# EasyEDA Pro project ProDoc_PT2470.epro

# Schematic Schematic1

## Sheets
1 stm32最小系统: Create Date: 2022-11-15; Page Name: stm32最小系统; Project Name: 四电机驱动板1; Schematic Name: Schematic1; Update Date: 2022-11-18; Add into BOM: yes; Convert to PCB: yes
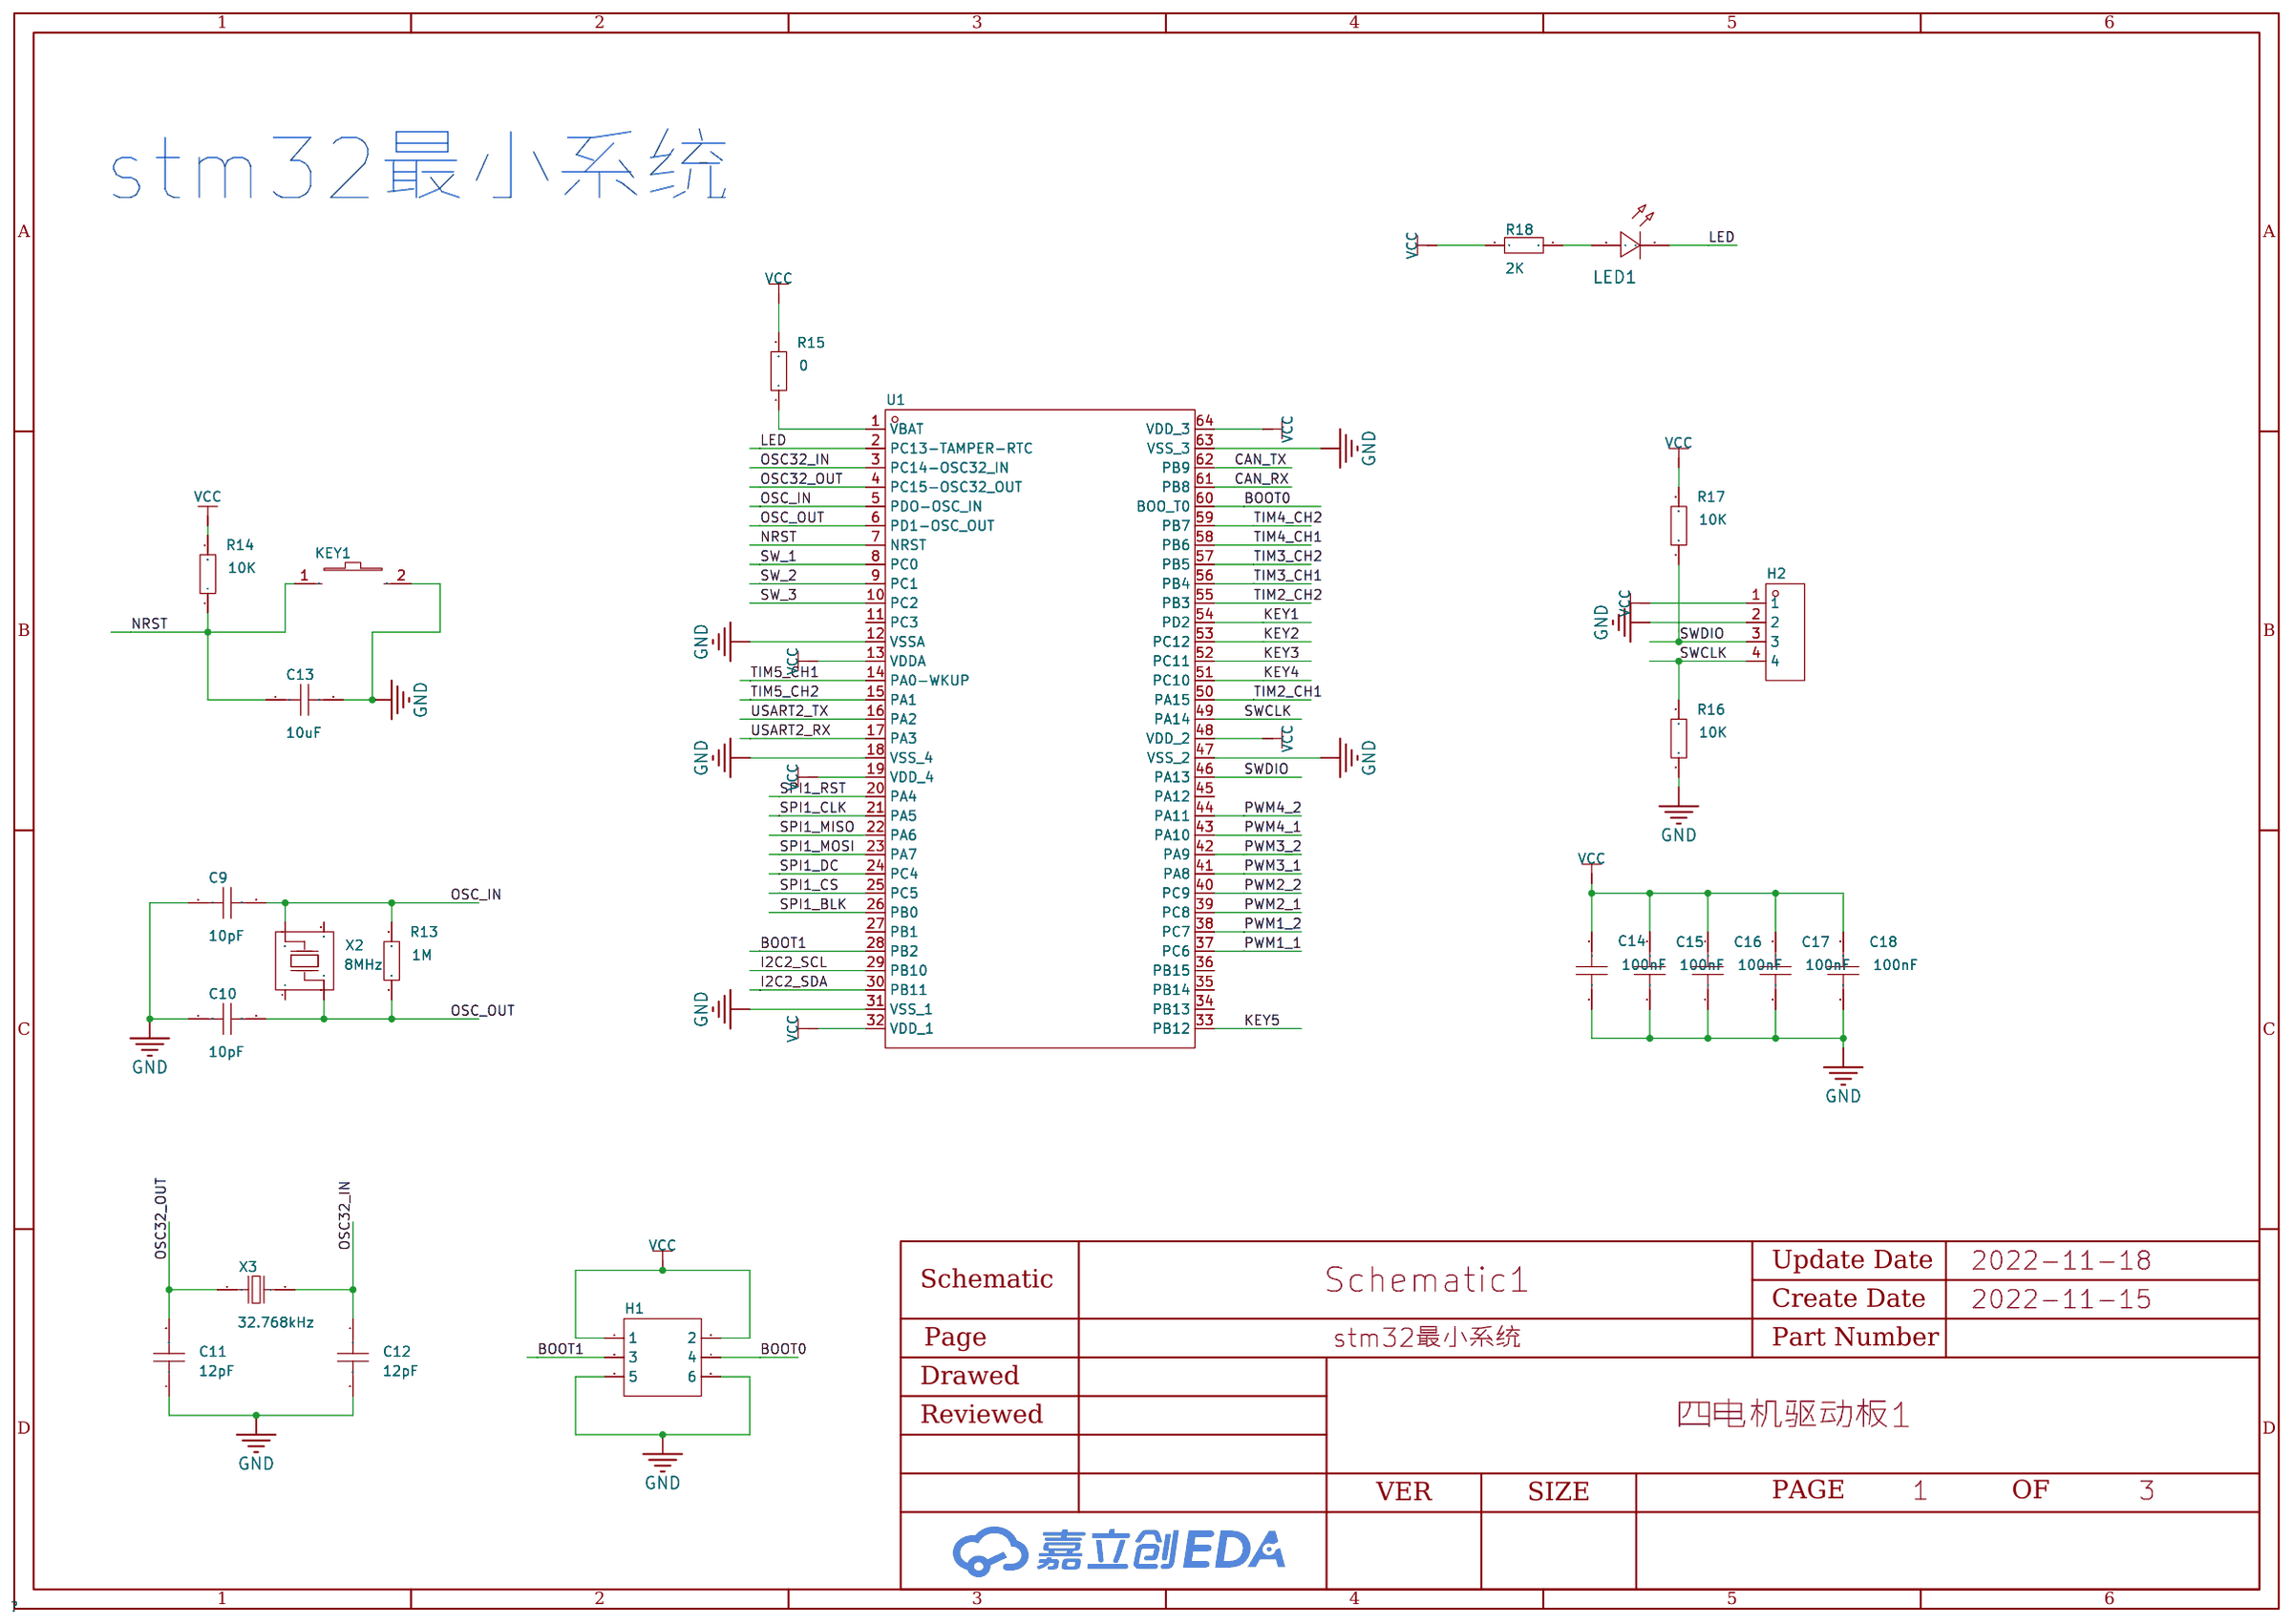
[diagram p0: stm32最小系统]
2 电机驱动PT2470: Page Name: 电机驱动PT2470; Company: 嘉立创EDA; Page Size: A4; Version: V1.0
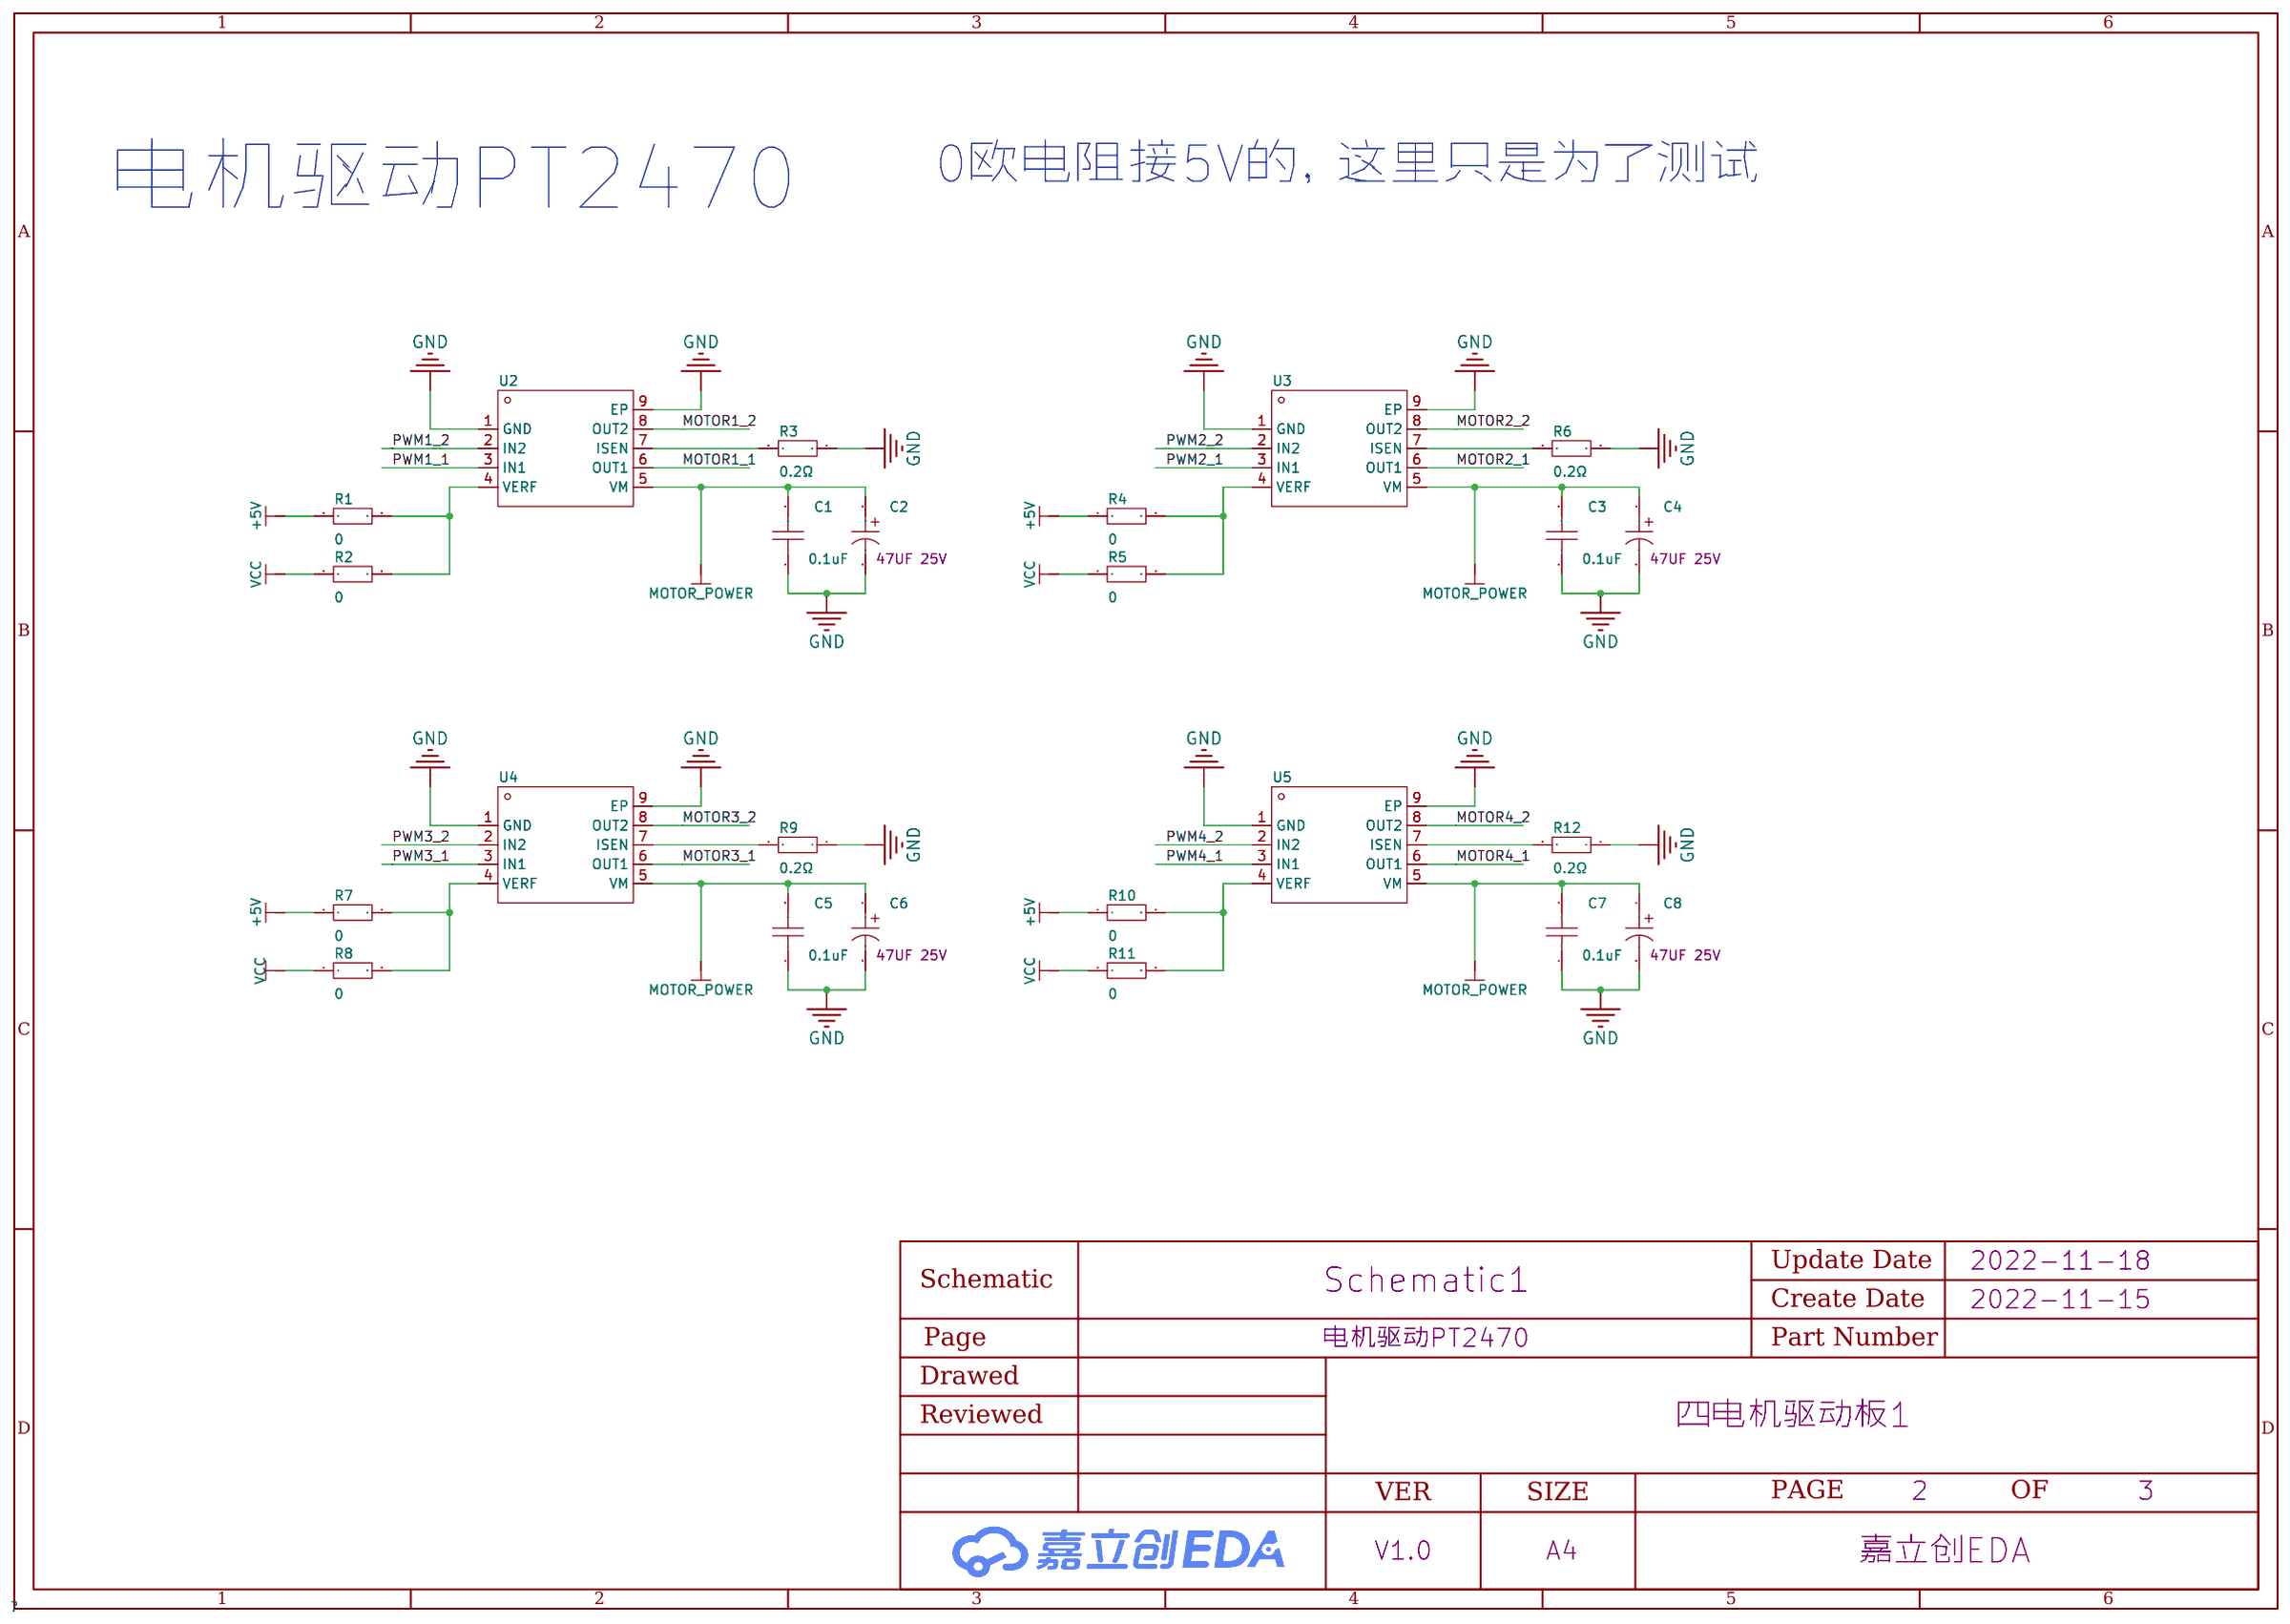
[diagram p1: 电机驱动PT2470]
3 其他模块: Page Name: 其他模块; Company: 嘉立创EDA; Page Size: A4; Version: V1.0
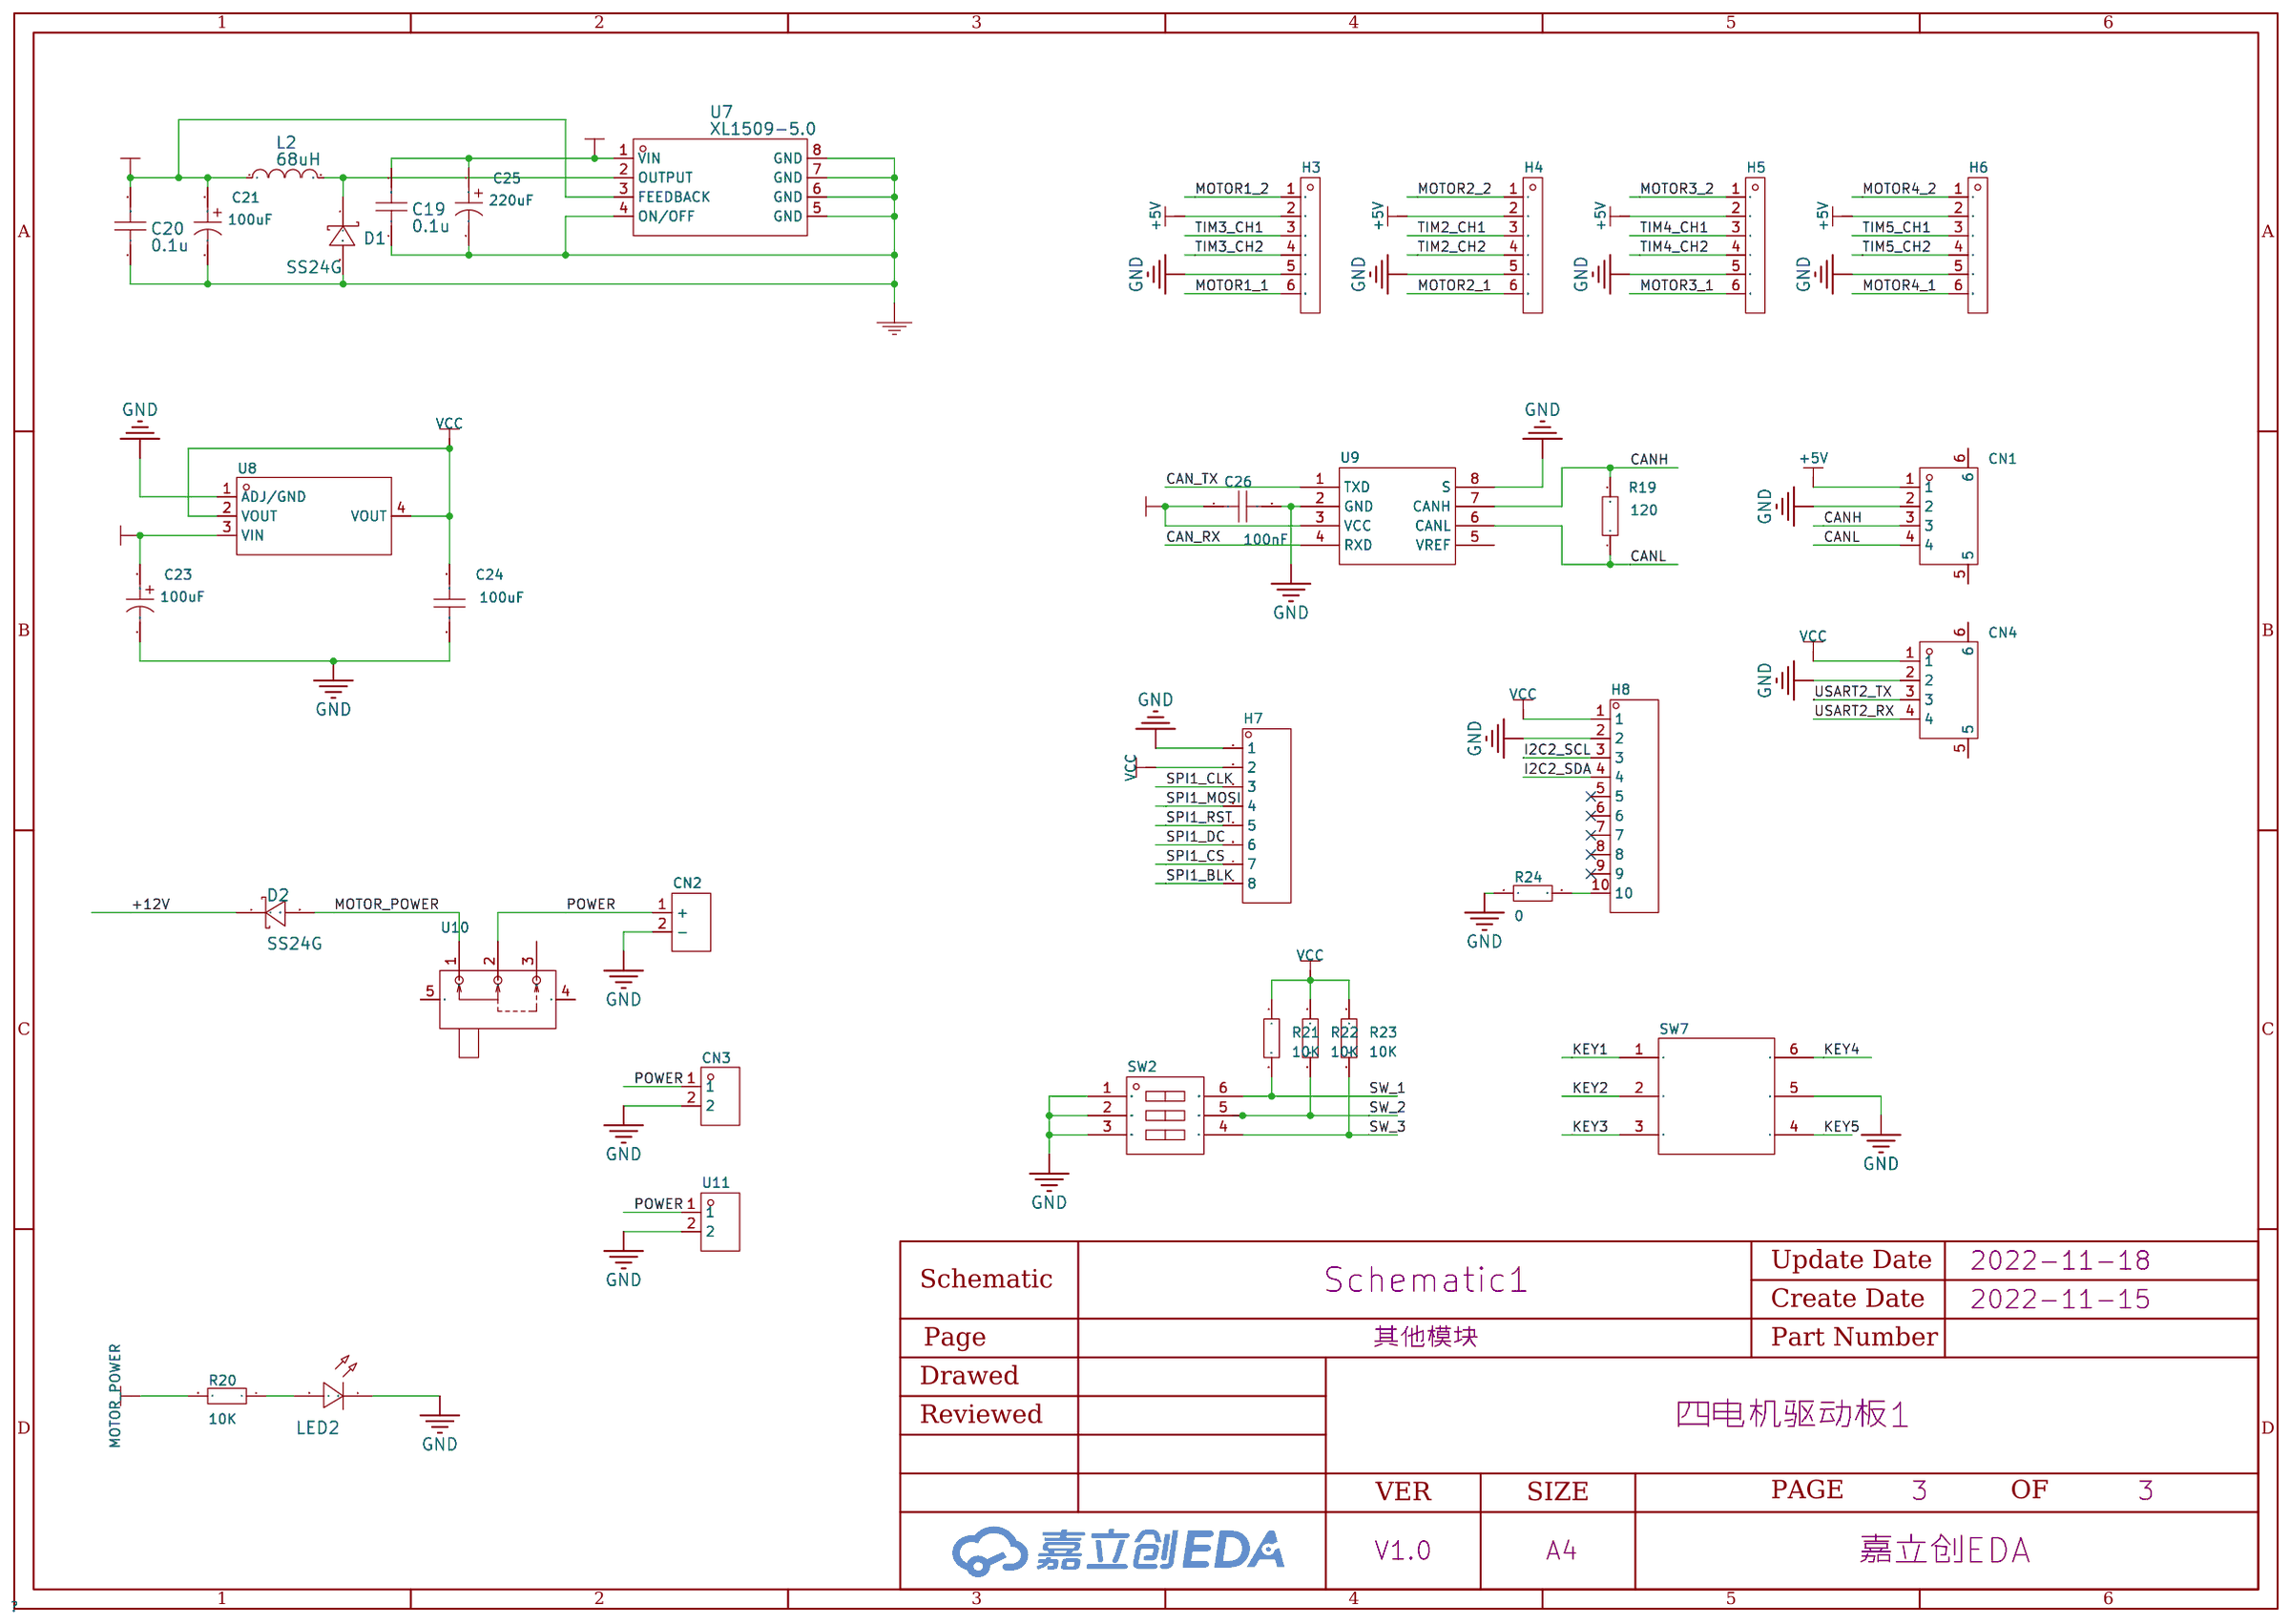
[diagram p2: 其他模块]

## Parts
sheet stm32最小系统
C9  10pF  [C0603]
C10  10pF  [C0603]
C11  12pF  [C0603]
C12  12pF  [C0603]
C13  10uF  [C0603]
C14  100nF  [C0603]
C15  100nF  [C0603]
C16  100nF  [C0603]
C17  100nF  [C0603]
C18  100nF  [C0603]
H1  -  [HDR-TH_6P-P2.54-V-F-R2-C3-S2.54]
H2  -  [HDR-TH_4P-P2.54-V-M]
KEY1  轻触开关3x4x2  [SW-SMD_L4.0-W2.9-LS5.0]
LED1  -  [LED0805-RD_RED]
R13  1M  [R0603]
R14  10K  [R0603]
R15  0  [R0805]
R16  10K  [R0603]
R17  10K  [R0603]
R18  2K  [R0603]
U1  -  [LQFP-64_L10.0-W10.0-P0.50-LS12.0-BL]
X2  8MHz  [OSC-SMD_4P-L3.2-W2.5-BL]
X3  32.768kHz  [FC-135R_L3.2-W1.5]
sheet 其他模块
C19  0.1u  [C0603]
C20  0.1u  [C0603]
C21  100uF  [CAP-SMD_BD6.3-L6.6-W6.6-LS7.3-FD]
C23  100uF  [CAP-SMD_BD6.3-L6.6-W6.6-LS7.3-FD]
C24  100uF  [C0603]
C25  220uF  [CAP-SMD_BD6.3-L6.6-W6.6-LS7.3-FD]
C26  100nF  [C0603]
CN1  PH-4P卧贴  [CONN-SMD_PH2.0-4PWB]
CN2  XT30UPB-F  [CONN-TH_XT30UPB-F]
CN3  XT30U-M  [CONN-TH_XT30U-M]
CN4  PH-4P卧贴  [CONN-SMD_PH2.0-4PWB]
D1  SS24G  [SMA_L4.4-W2.8-LS5.4-RD]
D2  SS24G  [SMA_L4.4-W2.8-LS5.4-RD]
H3  -  [CONN-TH_XH-6AW]
H4  -  [CONN-TH_XH-6AW]
H5  -  [CONN-TH_XH-6AW]
H6  -  [CONN-TH_XH-6AW]
H7  -  [HDR-TH_8P-P2.54-V-M]
H8  -  [HDR-TH_10P-P2.54-V-M-1]
L2  68uH  [IND-SMD_L5.8-W5.2_CD54T125NP-100MC]
LED2  -  [LED0805-RD_RED]
R19  120  [R0603]
R20  10K  [R0603]
R21  10K  [R0603]
R22  10K  [R0603]
R23  10K  [R0603]
R24  0  [R0603]
SW2  TO-03  [SW-SMD_6P-L7.6-W6.3-P2.54-LS9.8]
SW7  7*7*5-6P-L WX  [SW-SMD_6P-L7.0-W7.0-P1.40-LS7.4]
U7  XL1509-5.0  [SOIC-8_L5.0-W4.0-P1.27-LS6.0-BL]
U8  AMS1117-3.3  [SOT-223_L6.5-W3.5-P2.30-LS7.0-BR]
U9  TJA1050T/CM,118  [SOIC-8_L5.0-W4.0-P1.27-LS6.0-BL]
U10  SS-12F23-G4  [SW-TH_SS-12F23-G040]
U11  KF127-5.08-2P  [CONN-TH_P5.08_KF127-5.08-2P]
sheet 电机驱动PT2470
C1  0.1uF  [C0603]
C2  -  [CAP-SMD_BD6.3-L6.6-W6.6-LS7.6-FD]
C3  0.1uF  [C0603]
C4  -  [CAP-SMD_BD6.3-L6.6-W6.6-LS7.6-FD]
C5  0.1uF  [C0603]
C6  -  [CAP-SMD_BD6.3-L6.6-W6.6-LS7.6-FD]
C7  0.1uF  [C0603]
C8  -  [CAP-SMD_BD6.3-L6.6-W6.6-LS7.6-FD]
R1  0  [R0603]
R2  0  [R0603]
R3  0.2Ω  [R1206]
R4  0  [R0603]
R5  0  [R0603]
R6  0.2Ω  [R1206]
R7  0  [R0603]
R8  0  [R0603]
R9  0.2Ω  [R1206]
R10  0  [R0603]
R11  0  [R0603]
R12  0.2Ω  [R1206]
U2  -  [HSOP-8_L5.0-W4.0-P1.27-LS6.2-BL-EP]
U3  -  [HSOP-8_L5.0-W4.0-P1.27-LS6.2-BL-EP]
U4  -  [HSOP-8_L5.0-W4.0-P1.27-LS6.2-BL-EP]
U5  -  [HSOP-8_L5.0-W4.0-P1.27-LS6.2-BL-EP]

## Library data of the parts
C1 C3 C5 C7 C9-C12 C24 C26 = CAP_0603: Supplier Footprint: 0603
C13 = C0603: 容值:100nF;精度:±10%;额定电压:50V;材质(温度系数):X7R;; LCSC Part Name: 100nF ±10% 50V; Supplier Part: C14663; Manufacturer: YAGEO(国巨); Manufacturer Part: CC0603KRX7R9BB104; Supplier Footprint: 0603; JLCPCB Part Class: Basic Part; Datasheet: https://atta.szlcsc.com/upload/public/pdf/source/20170116/1484561234239.pdf; Supplier: LCSC; Tolerance: ±10%; Voltage Rated: 50V; Temperature Coefficient: X7R
C14-C18 = CAP_0805: Supplier Footprint: 0805
H1 = HDR-F_2.54_2x3: Supplier Part: C92272; Supplier Footprint: 插件
H2 = HDR-M_2.54_1x4P: Supplier Part: C492403; Supplier Footprint: 插件
KEY1 = 轻触开关3x4x2: 触点电流:50mA;额定电压(DC):12V;电路结构:单刀单掷;安装方式:立贴;按钮形状:圆形按钮;带灯:-;开关长度:4mm;开关宽度:3mm;开关高度:2mm;; LCSC Part Name: 3x4x2  柱高0.5; Supplier Part: C26638; Manufacturer: 国产; Supplier Footprint: SMD; JLCPCB Part Class: 扩展库; Datasheet: https://atta.szlcsc.com/upload/public/pdf/source/20150923/1457707412058.pdf; Supplier: LCSC; Contact Current: 50mA; Voltage Rating (DC): 12V; Circuit: 单刀单掷; Mounting Style: 立贴; Actuator Style: 圆形按钮; Switch Length: 4mm; Switch Width: 3mm; Switch Height: 2mm
LED1 LED2 = LED_0805-R: Supplier Footprint: 0805
R1 R2 R4 R5 R7 R8 R10 R11 R13 R14 R16-R24 = Res_0603: Supplier Footprint: 0603
R15 = Res_0805: Supplier Footprint: 0805
U1 = STM32F103RCT6: 主频（MAX):72MHz;工作电压:2V ~ 3.6V;; Supplier Part: C8323; Manufacturer: ST(意法半导体); Supplier Footprint: LQFP-64_10x10x05P; JLCPCB Part Class: Extended Part; Datasheet: https://atta.szlcsc.com/upload/public/pdf/source/20161130/1480498797345.pdf; Supplier: LCSC; Speed: 72MHz; Voltage - Supply (Vcc/Vdd): 2V ~ 3.6V; Program Memory Size: 256KB; RAM Size: 48KB; Number of I/O: 51; A/D: 16x12bit; D/A: 2x12bit; PWM: 18; LCD: LCD parallel interface, 8080/6800 modes; UART/USART: 3 USART+2 UART; SPI: 3; I2C（SMBUS/PMBUS）: 2; USB Device: 1; CAN: 1
X2 = TAXM8M4RDBCCT2T: 晶振类型:SMD 谐振器;频率:8MHz;频率公差:±10ppm;频率稳定度:±15ppm;负载电容:10pF;等效串联电阻(ESR):250Ω;工作温度:-;; LCSC Part Name: 8MHz ±10ppm 10pF; Supplier Part: C400090; Manufacturer: TAE(雅晶鑫); Supplier Footprint: SMD3225-4P; JLCPCB Part Class: 扩展库; Datasheet: https://atta.szlcsc.com/upload/public/pdf/source/20190626/C400090_CF95B89E745AFE4EF2E392EF8AC009D6.pdf; Supplier: LCSC; Crystal Type: SMD 谐振器; Frequency Tolerance: ±10ppm; Frequency Stability: ±15ppm; Load Capacitance: 10pF; Equivalent Series Resistance (ESR): 250Ω
X3 = Q13FC1350000400: 晶振类型:贴片无源晶振;频率:32.768kHz;频率公差:±20ppm;负载电容:12.5pF;等效串联电阻(ESR):70kΩ;工作温度:-40~+85;; LCSC Part Name: 32.768kHz ±20ppm 12.5pF; Supplier Part: C32346; Manufacturer: EPSON(爱普生); Supplier Footprint: SMD3215-2P; JLCPCB Part Class: 基础库; Datasheet: https://atta.szlcsc.com/upload/public/pdf/source/20190108/C32346_746D6B07EAF90824457A96480007685F.pdf; Supplier: LCSC; Crystal Type: 贴片无源晶振; Frequency Tolerance: ±20ppm; Load Capacitance: 12.5pF; Equivalent Series Resistance (ESR): 70kΩ; Operating Temperature: -40~+85
C19 C20 = 0.1u
C21 C23 = XT100UF16V90RV0074: 容值:100uF;精度:±20%;额定电压:16V;电容体直径:6.3mm;电容体长度:7.7mm;纹波电流:85mA@120Hz;工作寿命:2000hrs@105;工作温度:-55~+105;; LCSC Part Name: 100uF ±20% 16V; Supplier Part: C2992605; Manufacturer: KNSCHA(科尼盛); Supplier Footprint: SMD,D6.3xL7.7mm; Datasheet: https://atta.szlcsc.com/upload/public/pdf/source/20220628/7CAC947F1CF7B3760324B7CEF365CD7C.pdf; Supplier: LCSC; Tolerance: ±20%; Rated Voltage: 16V; φD: 6.3mm; L: 7.7mm; Ripple Current: 85mA@120Hz; Lifetime @ Temp: 2000hrs@105; Operating Temperature: -55~+105
C25 = XT220UF25V90RV0075: 容值:220uF;额定电压:25V;电容体直径:-;电容体长度:-;纹波电流:-;等效串联电阻:-;工作寿命:-;; LCSC Part Name: 220uF 25V; Supplier Part: C2992606; Manufacturer: KNSCHA(科尼盛); Supplier Footprint: SMD,6.3x7.7mm; JLCPCB Part Class: 扩展库; Datasheet: https://atta.szlcsc.com/upload/public/pdf/source/20220628/B81E91792433B702C6CB5381AD404A15.pdf; Supplier: LCSC; Rated Voltage: 25V
CN1 CN4 = PH-4P卧贴: 参考系列:PH;间距:2mm;插针结构:1x4P;排数:1;每排PIN数:4;行距:-;安装方式:-;触头材质:-;; LCSC Part Name: PH2.0-4PWB  4P 间距2.0mm; Supplier Part: C50137; Manufacturer: BOOMELE(博穆精密); Supplier Footprint: SMD,P=2mm; JLCPCB Part Class: 扩展库; Datasheet: https://atta.szlcsc.com/upload/public/pdf/source/20201021/C50137_92282A9B69C22D3BCC62949EB13F278D.pdf; Supplier: LCSC; Reference Series: PH; Pitch: 2mm; Pins Structure: 1x4P; Number of Rows: 1; Number of PINs Per Row: 4
CN2 = XT30UPB-F: 模型插头连接器; Supplier Part: C108769; Manufacturer: AMASS(艾迈斯); Supplier Footprint: 间距5mm; JLCPCB Part Class: 扩展库; Datasheet: https://atta.szlcsc.com/upload/public/pdf/source/20180126/C108769_15169557890251308829.pdf; Supplier: LCSC
CN3 = XT30U-M: 模型插头轻量版锂电池插头; LCSC Part Name: XT30U-M 公头; Supplier Part: C99101; Manufacturer: AMASS(艾迈斯); JLCPCB Part Class: 扩展库; Datasheet: https://atta.szlcsc.com/upload/public/pdf/source/20170606/1496716542582.pdf; Supplier: LCSC
D1 D2 = SS24G: Supplier: LCSC; Supplier Part: C183481; Manufacturer: SK; JLCPCB Part Class: Extended Part
H3-H6 = XH2.54-6P卧插: 参考系列:XH;间距:2.5mm;插针结构:1x6P;排数:1;每排PIN数:6;行距:-;安装方式:-;触头材质:-;; LCSC Part Name: XH-6AW，6P，脚距2.5mm，卧插; Supplier Part: C8876; Manufacturer: BOOMELE(博穆精密); Manufacturer Part: XH-6AW; LCSC On Sale: 1; Supplier Footprint: 插件,P=2.5mm; JLCPCB On Sale: 1; Datasheet: https://atta.szlcsc.com/upload/public/pdf/source/20151222/1457707652916.pdf; Supplier: LCSC; Reference Series: XH; Pitch: 2.5mm; Pins Structure: 1x6P; Number of Rows: 1; Number of PINs Per Row: 6; JLCPCB Part Class: 扩展库
H7 = HDR-M_2.54_1x8P: Supplier Part: C124381; Supplier Footprint: 插件
H8 = HDR-M_2.54_1x10P: Supplier Part: C57369; Supplier Footprint: 插件
L2 = CD54T125NP-100MC: Supplier: LCSC; Supplier Part: C171575; Manufacturer: Sumida; JLCPCB Part Class: Extended Part
SW2 = TO-03: 拨码开关贴片黑色03P-3PIN间距2.54mm立式贴片正拨平拨3位SMD; LCSC Part Name: 拨码开关贴片黑色03P-3PIN间距2.54mm立式贴片正拨平拨3位SMD; Supplier Part: C703800; Manufacturer: Yuandi(台湾元迪); Supplier Footprint: SMD; JLCPCB Part Class: 扩展库; Datasheet: https://atta.szlcsc.com/upload/public/pdf/source/20200720/C703800_80E8AF9DC4C3CB8A32EAD0AE4E67587B.pdf; Supplier: LCSC
SW7 = 7*7*5-6P-L WX: 额定电流(DC)：50mA 额定电压(DC)：12V 电路结构：单刀五掷 机械寿命：30000 安装方式：SMD 工作温度：-20~+70 开关长度：7.4mm 开关宽度：7.4mm 开关高度：5mm; Supplier Part: C2858287; Manufacturer: SHOU HAN(首韩); Supplier Footprint: SMD; JLCPCB Part Class: 扩展库; Datasheet: https://atta.szlcsc.com/upload/public/pdf/source/20210806/C2858287_7956E179246BF43E1C1955FBC790E2E6.pdf; Supplier: LCSC
U7 = XL1509-5.0: Supplier: LCSC; Supplier Part: C2681225; Manufacturer: UMW(友台半导体); JLCPCB Part Class: Extended Part
U8 = AMS1117-3.3_C351785: Supplier Part: C351785; Manufacturer: PUOLOP(迪浦); Supplier Footprint: SOT-223; JLCPCB Part Class: 扩展库; Datasheet: https://atta.szlcsc.com/upload/public/pdf/source/20210915/EA806799CEEC3F52E0A4FA8303A508AC.pdf; Supplier: LCSC
U9 = TJA1050T/CM,118: 类型:收发器;协议类别:CAN总线;; Supplier Part: C6952; Manufacturer: NXP(恩智浦); Supplier Footprint: SOIC-8_150mil; JLCPCB Part Class: 基础库; Datasheet: https://atta.szlcsc.com/upload/public/pdf/source/20140411/1457707042917.pdf; Supplier: LCSC; Type: 收发器; Protocol: CAN总线; Supply Voltage: 4.75V ~ 5.25V
U10 = SS-12F23-G4: 电路结构:单刀双掷;安装方式:卧插;开关颜色:黑色;滑钮形状:矩形柱状;引脚样式:PC引脚;开关长度:13mm;开关宽度:5.8mm;开关高度:9mm;; LCSC Part Name: 拨动开关; Supplier Part: C2998806; Manufacturer: DEALON(德艺隆); Supplier Footprint: 插件; JLCPCB Part Class: 扩展库; Datasheet: https://atta.szlcsc.com/upload/public/pdf/source/20220428/B341684C4335C21BC408331FBC341DAE.pdf; Supplier: LCSC; Circuit: 单刀双掷; Mounting Style: 卧插; Actuator Color: 黑色; Actuator Style: 矩形柱状; Pin Style: PC引脚; Switch Length: 13mm; Switch Width: 5.8mm; Switch Height: 9mm
U11 = KF127-5.08-2P: 间距:5.08mm;排数:1;每排PIN数:2;安装方式:直针;额定电流:15A;额定电压:250V;线规 - AWG:14~26;线规 - mm?:1.5;工作温度范围:-40~+105;颜色:绿色;; LCSC Part Name: 5.08mm 排数:1 每排P数:2 直针 可拼接 铜 环保; Supplier Part: C474906; Manufacturer: KEFA(科发); Supplier Footprint: P=5.08mm; JLCPCB Part Class: 扩展库; Datasheet: https://atta.szlcsc.com/upload/public/pdf/source/20200115/C474906_30398C25D2112436770FB13658A99DF4.pdf; Supplier: LCSC; Pitch: 5.08mm; Number of Rows: 1; Number of PINs Per Row: 2; Mounting Style: 直针; Current Rating (Max): 15A; Voltage Rating (Max): 250V; Wire Gauge - AWG: 14~26; Wire Gauge - mm?: 1.5; Operating Temperature Range: -40~+105; Color: 绿色
C2 C4 C6 C8 = RVT47UF25V67RV0013: 工作寿命:2000hrs@105;; LCSC Part Name: 47UF 25V; Supplier Part: C2895279; Manufacturer: KNSCHA(科尼盛); Supplier Footprint: SMD,6.3x5.4mm; JLCPCB Part Class: Extended Part; Datasheet: https://atta.szlcsc.com/upload/public/pdf/source/20210913/D37A488B7B15F44D12FCF4B737D8388C.pdf; Supplier: LCSC; Lifetime @ Temp: 2000hrs@105
R3 R6 R9 R12 = Res_1206: Supplier Footprint: 1206; Temperature Coefficient: ±100ppm/; Operating Temperature Range: -55~+155
U2-U5 = PT2470: Supplier Part: C481904; Manufacturer: PTC(台湾普诚); Supplier Footprint: HSOP-8; JLCPCB Part Class: Extended Part; Datasheet: https://atta.szlcsc.com/upload/public/pdf/source/20200305/C481904_D1CA04D11589B286F6CF3C5077075D31.pdf; Supplier: LCSC

## Nets
+5V: C20.2 C21.1 C23.1 C26.1 CN1.1 H3.2 H4.2 H5.2 H6.2 L2.1 R1.1 R4.1 R7.1 R10.1 U7.3(FEEDBACK) U8.3(VIN) U9.3(VCC)
+12V: C19.2 C25.1 D2.1 U7.1(VIN)
GND: C1.1 C2.2 C3.1 C4.2 C5.1 C6.2 C7.1 C8.2 C9.1 C10.1 C11.1 C12.2 C13.2 C14.1 C15.1 C16.1 C17.1 C18.1 C19.1 C20.1 C21.2 C23.2 C24.1 C25.2 C26.2 CN1.2 CN2.2(-) CN3.2 CN4.2 D1.2 H1.5 H1.6 H2.2 H3.5 H4.5 H5.5 H6.5 H7.1 H8.2 KEY1.2 LED2.1(C) R3.1 R6.1 R9.1 R12.1 R16.1 R24.1 SW2.1(PIN1) SW2.2(PIN2) SW2.3(PIN3) SW7.5 U1.12(VSSA) U1.18(VSS_4) U1.31(VSS_1) U1.47(VSS_2) U1.63(VSS_3) U2.1(GND) U2.9(EP) U3.1(GND) U3.9(EP) U4.1(GND) U4.9(EP) U5.1(GND) U5.9(EP) U7.4(ON/OFF) U7.5(GND) U7.6(GND) U7.7(GND) U7.8(GND) U8.1(ADJ/GND) U9.2(GND) U9.8(S) U11.2
VCC: C14.2 C15.2 C16.2 C17.2 C18.2 C24.2 CN4.1 H1.1 H1.2 H2.1 H7.2 H8.1 R2.1 R5.1 R8.1 R11.1 R14.2 R15.2 R17.2 R18.2 R21.1 R22.1 R23.1 U1.13(VDDA) U1.19(VDD_4) U1.32(VDD_1) U1.48(VDD_2) U1.64(VDD_3) U8.2(VOUT) U8.4(VOUT)
BOOT0: H1.4 U1.60(BOO_T0)
BOOT1: H1.3 U1.28(PB2)
CAN_RX: U1.61(PB8) U9.4(RXD)
CAN_TX: U1.62(PB9) U9.1(TXD)
CANH: CN1.3 R19.2 U9.7(CANH)
CANL: CN1.4 R19.1 U9.6(CANL)
I2C2_SCL: H8.3 U1.29(PB10)
I2C2_SDA: H8.4 U1.30(PB11)
KEY1: SW7.1 U1.54(PD2)
KEY2: SW7.2 U1.53(PC12)
KEY3: SW7.3 U1.52(PC11)
KEY4: SW7.6 U1.51(PC10)
KEY5: SW7.4 U1.33(PB12)
LED: LED1.1(C) U1.2(PC13-TAMPER-RTC)
MOTOR1_1: H3.6 U2.6(OUT1)
MOTOR1_2: H3.1 U2.8(OUT2)
MOTOR2_1: H4.6 U3.6(OUT1)
MOTOR2_2: H4.1 U3.8(OUT2)
MOTOR3_1: H5.6 U4.6(OUT1)
MOTOR3_2: H5.1 U4.8(OUT2)
MOTOR4_1: H6.6 U5.6(OUT1)
MOTOR4_2: H6.1 U5.8(OUT2)
MOTOR_POWER: C1.2 C2.1 C3.2 C4.1 C5.2 C6.1 C7.2 C8.1 D2.2 R20.2 U2.5(VM) U3.5(VM) U4.5(VM) U5.5(VM) U10.1
NRST: C13.1 KEY1.1 R14.1 U1.7(NRST)
OSC32_IN: C12.1 U1.3(PC14-OSC32_IN) X3.2
OSC32_OUT: C11.2 U1.4(PC15-OSC32_OUT) X3.1
OSC_IN: C9.2 R13.2 U1.5(PDO-OSC_IN) X2.3
OSC_OUT: C10.2 R13.1 U1.6(PD1-OSC_OUT) X2.1
POWER: CN2.1(+) CN3.1 U10.2 U11.1
PWM1_1: U1.37(PC6) U2.3(IN1)
PWM1_2: U1.38(PC7) U2.2(IN2)
PWM2_1: U1.39(PC8) U3.3(IN1)
PWM2_2: U1.40(PC9) U3.2(IN2)
PWM3_1: U1.41(PA8) U4.3(IN1)
PWM3_2: U1.42(PA9) U4.2(IN2)
PWM4_1: U1.43(PA10) U5.3(IN1)
PWM4_2: U1.44(PA11) U5.2(IN2)
SPI1_BLK: H7.8 U1.26(PB0)
SPI1_CLK: H7.3 U1.21(PA5)
SPI1_CS: H7.7 U1.25(PC5)
SPI1_DC: H7.6 U1.24(PC4)
SPI1_MISO: U1.22(PA6)
SPI1_MOSI: H7.4 U1.23(PA7)
SPI1_RST: H7.5 U1.20(PA4)
SW_1: R21.2 SW2.6(PIN6) U1.8(PC0)
SW_2: R22.2 SW2.5(PIN5) U1.9(PC1)
SW_3: R23.2 SW2.4(PIN4) U1.10(PC2)
SWCLK: H2.4 R16.2 U1.49(PA14)
SWDIO: H2.3 R17.1 U1.46(PA13)
TIM2_CH1: H4.3 U1.50(PA15)
TIM2_CH2: H4.4 U1.55(PB3)
TIM3_CH1: H3.3 U1.56(PB4)
TIM3_CH2: H3.4 U1.57(PB5)
TIM4_CH1: H5.3 U1.58(PB6)
TIM4_CH2: H5.4 U1.59(PB7)
TIM5_CH1: H6.3 U1.14(PA0-WKUP)
TIM5_CH2: H6.4 U1.15(PA1)
USART2_RX: CN4.4 U1.17(PA3)
USART2_TX: CN4.3 U1.16(PA2)
$1N7489: R15.1 U1.1(VBAT)
$1N10210: LED1.2(A) R18.1
$2N973: R1.2 R2.2 U2.4(VERF)
$2N1193: R3.2 U2.7(ISEN)
$2N2351: R4.2 R5.2 U3.4(VERF)
$2N2356: R6.2 U3.7(ISEN)
$2N3284: R7.2 R8.2 U4.4(VERF)
$2N3289: R9.2 U4.7(ISEN)
$2N4229: R10.2 R11.2 U5.4(VERF)
$2N4234: R12.2 U5.7(ISEN)
$3N961: D1.1 L2.2 U7.2(OUTPUT)
$3N15267: H8.10 R24.2
$3N17066: LED2.2(A) R20.1

Not connected (* = marked no-connect by the designer): CN1 5 6; CN4 5 6; H8 5* 6* 7* 8* 9*; U1 11(PC3) 27(PB1) 34(PB13) 35(PB14) 36(PB15) 45(PA12); U9 5(VREF); U10 3 4 5; X2 2 4

## Notes on the sheets
sheet 1
- stm32最小系统
sheet 2
- 0欧电阻接5V的，这里只是为了测试
- 电机驱动PT2470

# Board PCB1
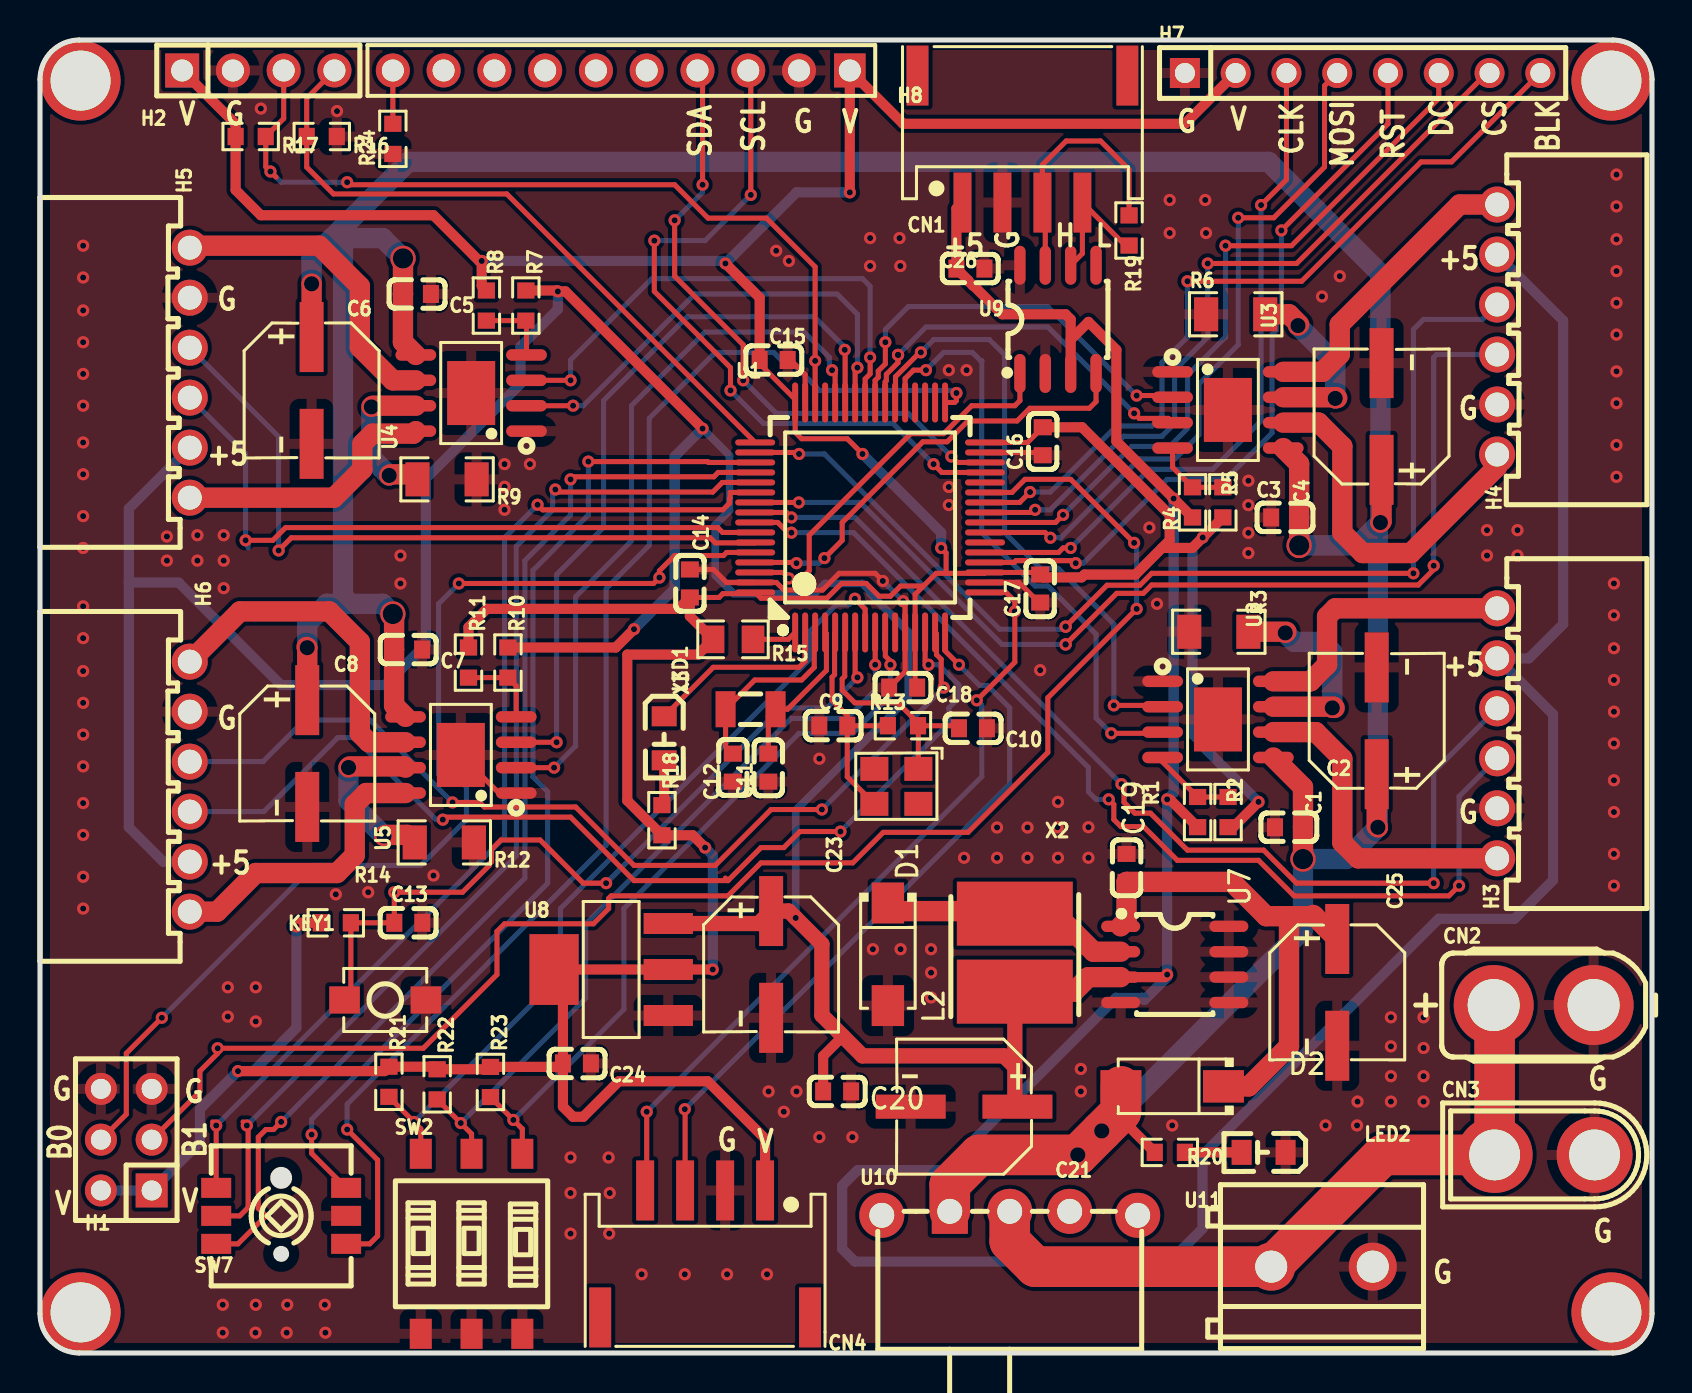
[diagram p3: board, top side]
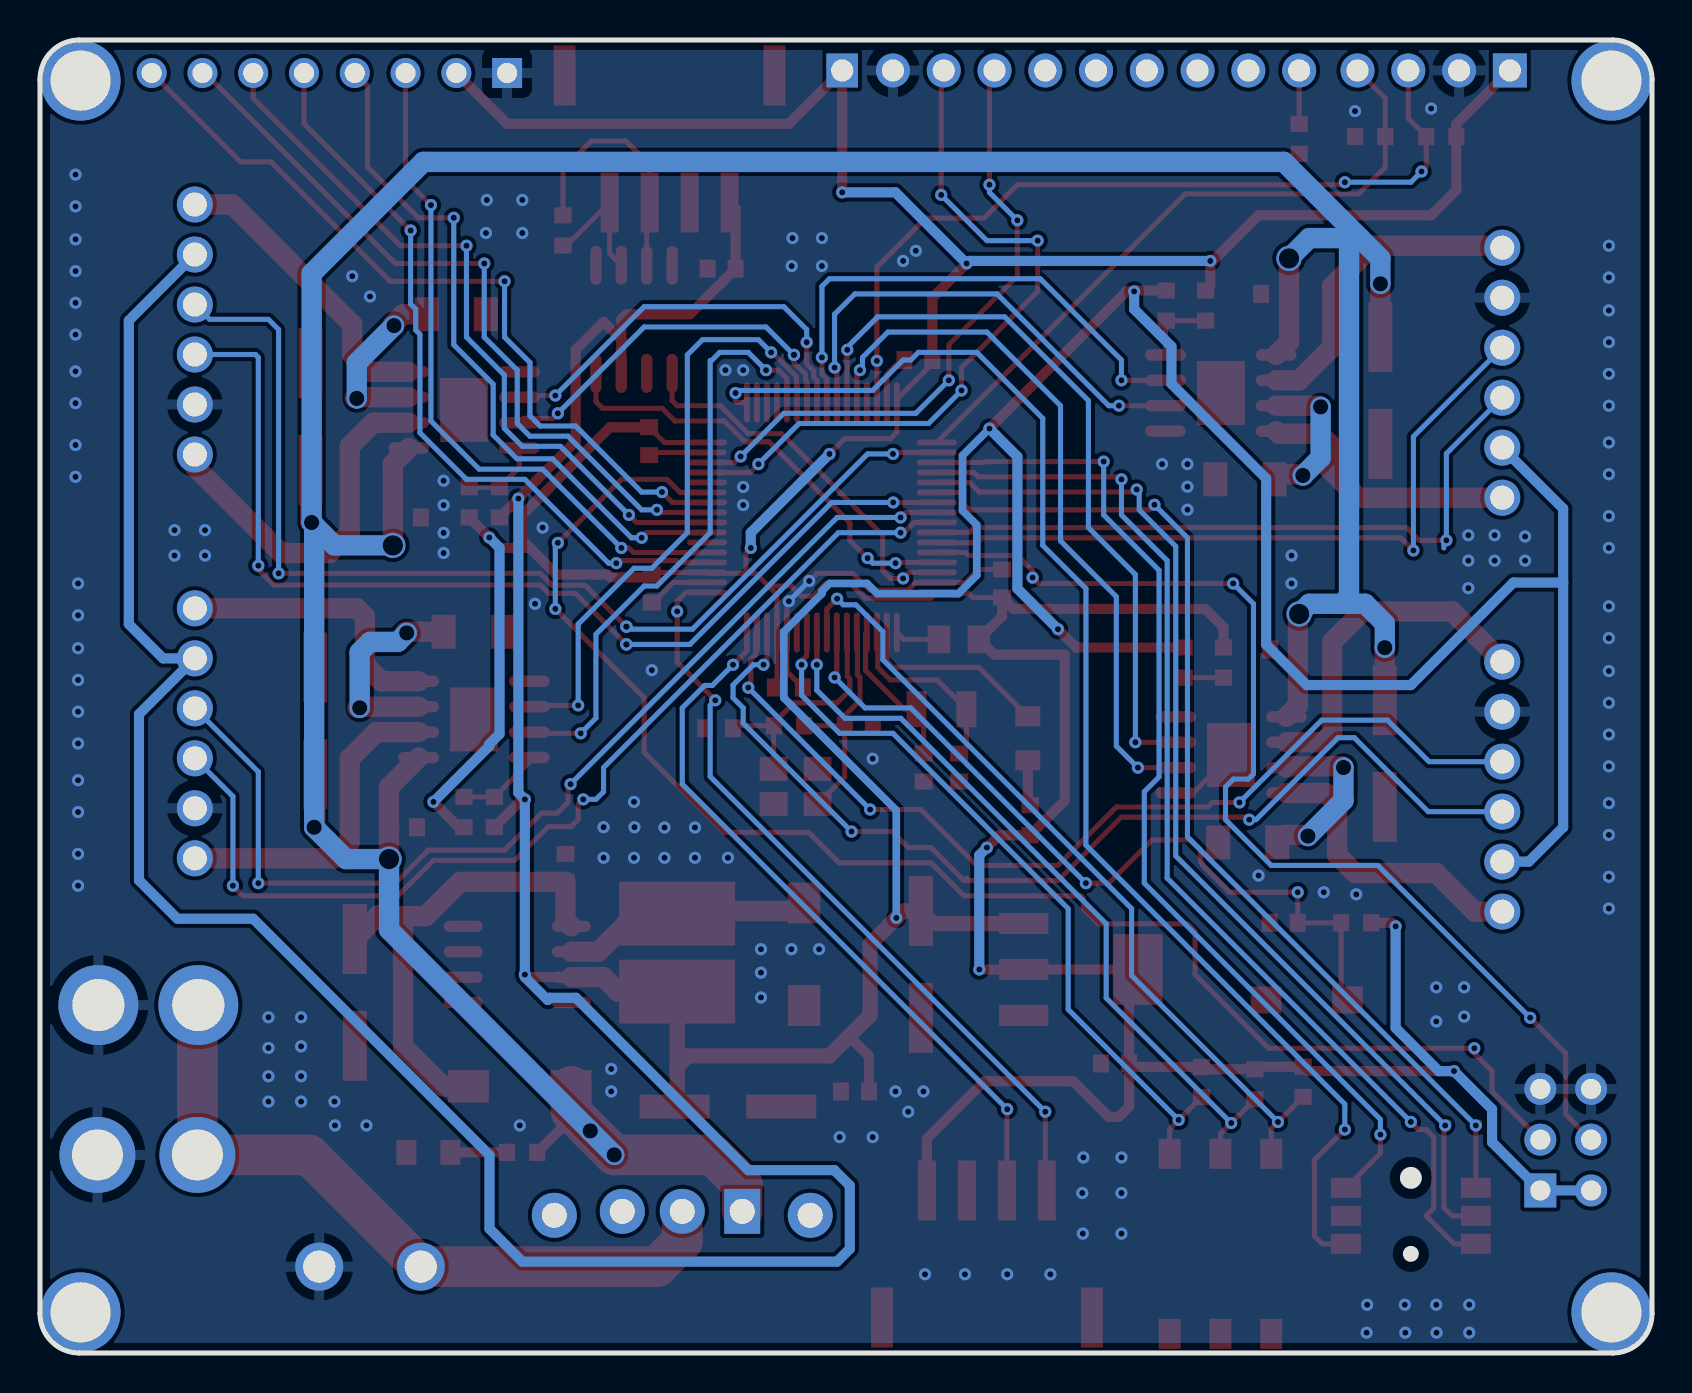
[diagram p4: board, bottom side, seen from below]

Outline 80.64 x 65.66 mm; copper layers: Top Layer, Bottom Layer. Coordinates in mm from the lower left corner of the outline.
Outline path: 0,63.69 0,1.97 arc(0.58,0.58) 1.97,0 78.67,0 arc(80.07,0.58) 80.64,1.97 80.64,63.69 arc(80.07,65.08) 78.67,65.66 1.97,65.66 arc(0.58,65.08) 0,63.69
Stack: Top Layer 0.035mm / Dielectric1 1.51mm FR4 er 4.5 / Bottom Layer 0.035mm

## Design rules (mm)
spacing safeClearance (default): track to track 0.152, other pairs 0 to 0.152
track width trackWidth (default): min 0.127, default 0.254, max 2.54
track width trackWidth1: min 0.254, default 0.508, max 2.54
track width MotorPower: min 0.127, default 1.016, max 2.54
differential pair differentialPair (default): width min 0.127, default 0.254, max 2.54; gap min 0.152, default 0.152
via viaSize (default): diameter min 0.5, default 0.61, max 10; hole min 0.3, default 0.305, max 6
net MOTOR_POWER uses MotorPower
net +5V uses trackWidth1
net VCC uses trackWidth1

## Placement (name value [footprint] x y rotation side)
C1  0.1uF  [C0603]  62.48 26.29 0 top
C2  -  [CAP-SMD_BD6.3-L6.6-W6.6-LS7.6-FD]  66.87 31.61 90 top
C3  0.1uF  [C0603]  62.29 41.78 0 top
C4  -  [CAP-SMD_BD6.3-L6.6-W6.6-LS7.6-FD]  67.11 46.83 90 top
C5  0.1uF  [C0603]  18.86 52.96 180 top
C6  -  [CAP-SMD_BD6.3-L6.6-W6.6-LS7.6-FD]  13.59 48.13 270 top
C7  0.1uF  [C0603]  18.41 35.18 180 top
C8  -  [CAP-SMD_BD6.3-L6.6-W6.6-LS7.6-FD]  13.37 29.98 270 top
C9  10pF  [C0603]  39.69 31.37 0 top
C10  10pF  [C0603]  46.67 31.24 180 top
C11  12pF  [C0603]  36.44 29.27 90 top
C12  12pF  [C0603]  34.66 29.27 270 top
C13  10uF  [C0603]  18.43 21.51 0 top
C14  100nF  [C0603]  32.51 38.48 270 top
C15  100nF  [C0603]  36.7 49.66 180 top
C16  100nF  [C0603]  50.17 45.59 90 top
C17  100nF  [C0603]  50.04 38.23 90 top
C18  100nF  [C0603]  43.18 33.27 0 top
C19  0.1u  [C0603]  54.36 24.26 270 top
C20  0.1u  [C0603]  39.88 13.08 180 top
C21  100uF  [CAP-SMD_BD6.3-L6.6-W6.6-LS7.3-FD]  46.23 12.32 180 top
C23  100uF  [CAP-SMD_BD6.3-L6.6-W6.6-LS7.3-FD]  36.58 19.43 270 top
C24  100uF  [C0603]  26.86 14.48 180 top
C25  220uF  [CAP-SMD_BD6.3-L6.6-W6.6-LS7.3-FD]  64.9 18.03 270 top
C26  100nF  [C0603]  46.55 54.23 0 top
CN1  PH-4P卧贴  [CONN-SMD_PH2.0-4PWB]  49.15 60.71 0 top
CN2  XT30UPB-F  [CONN-TH_XT30UPB-F]  75.22 17.4 0 top
CN3  XT30U-M  [CONN-TH_XT30U-M]  75.27 9.91 0 top
CN4  PH-4P卧贴  [CONN-SMD_PH2.0-4PWB]  33.27 4.95 180 top
D1  SS24G  [SMA_L4.4-W2.8-LS5.4-RD]  42.42 19.94 270 top
D2  SS24G  [SMA_L4.4-W2.8-LS5.4-RD]  56.64 13.33 180 top
H1  -  [HDR-TH_6P-P2.54-V-F-R2-C3-S2.54]  4.32 10.67 90 top
H2  -  [HDR-TH_4P-P2.54-V-M]  10.92 64.13 0 top
H3  -  [CONN-TH_XH-6AW]  72.9 30.99 90 top
H4  -  [CONN-TH_XH-6AW]  72.9 51.18 90 top
H5  -  [CONN-TH_XH-6AW]  7.49 49.02 270 top
H6  -  [CONN-TH_XH-6AW]  7.49 28.32 270 top
H7  -  [HDR-TH_8P-P2.54-V-M]  66.17 64.01 0 top
H8  -  [HDR-TH_10P-P2.54-V-M-1]  29.08 64.13 180 top
KEY1  轻触开关3x4x2  [SW-SMD_L4.0-W2.9-LS5.0]  17.27 17.65 0 top
L2  68uH  [IND-SMD_L5.8-W5.2_CD54T125NP-100MC]  48.77 20.02 90 top
LED1  -  [LED0805-RD_RED]  31.23 30.74 270 top
LED2  -  [LED0805-RD_RED]  61.21 10.03 180 top
NOREF  -  [Pad_e5]  78.61 2.03 0 top
NOREF#2  -  [Pad_e6]  2.03 2.03 0 top
NOREF#3  -  [Pad_e4]  78.61 63.63 0 top
NOREF#4  -  [Pad_e2]  2.03 63.63 0 top
R1  0  [R0603]  57.91 27.05 90 top
R2  0  [R0603]  59.44 27.05 90 top
R3  0.2Ω  [R1206]  58.97 36.07 0 top
R4  0  [R0603]  57.66 42.54 90 top
R5  0  [R0603]  59.17 42.54 90 top
R6  0.2Ω  [R1206]  59.82 51.94 0 top
R7  0  [R0603]  24.31 52.38 270 top
R8  0  [R0603]  22.33 52.38 270 top
R9  0.2Ω  [R1206]  20.36 43.69 180 top
R10  0  [R0603]  23.41 34.53 270 top
R11  0  [R0603]  21.44 34.53 270 top
R12  0.2Ω  [R1206]  20.23 25.53 180 top
R13  1M  [R0603]  43.17 31.37 180 top
R14  10K  [R0603]  14.8 21.51 180 top
R15  0  [R0805]  34.67 35.69 180 top
R16  10K  [R0603]  14.1 60.83 180 top
R17  10K  [R0603]  10.54 60.83 180 top
R18  2K  [R0603]  31.11 26.64 270 top
R19  120  [R0603]  54.48 56.13 90 top
R20  10K  [R0603]  56.52 10.03 180 top
R21  10K  [R0603]  17.46 13.56 270 top
R22  10K  [R0603]  19.87 13.43 270 top
R23  10K  [R0603]  22.54 13.55 270 top
R24  0  [R0603]  17.65 60.71 90 top
SW2  TO-03  [SW-SMD_6P-L7.6-W6.3-P2.54-LS9.8]  21.59 5.46 0 top
SW7  7*7*5-6P-L WX  [SW-SMD_6P-L7.0-W7.0-P1.40-LS7.4]  12.06 6.86 0 top
U1  -  [LQFP-64_L10.0-W10.0-P0.50-LS12.0-BL]  41.53 41.78 0 top
U2  -  [HSOP-8_L5.0-W4.0-P1.27-LS6.2-BL-EP]  58.93 31.68 270 top
U3  -  [HSOP-8_L5.0-W4.0-P1.27-LS6.2-BL-EP]  59.43 47.16 270 top
U4  -  [HSOP-8_L5.0-W4.0-P1.27-LS6.2-BL-EP]  21.57 48 90 top
U5  -  [HSOP-8_L5.0-W4.0-P1.27-LS6.2-BL-EP]  21.06 29.91 90 top
U7  XL1509-5.0  [SOIC-8_L5.0-W4.0-P1.27-LS6.0-BL]  56.77 19.43 270 top
U8  AMS1117-3.3  [SOT-223_L6.5-W3.5-P2.30-LS7.0-BR]  28.58 19.18 0 top
U9  TJA1050T/CM,118  [SOIC-8_L5.0-W4.0-P1.27-LS6.0-BL]  50.93 51.69 0 top
U10  SS-12F23-G4  [SW-TH_SS-12F23-G040]  48.51 6.98 0 top
U11  KF127-5.08-2P  [CONN-TH_P5.08_KF127-5.08-2P]  64.14 4.32 0 top
X2  8MHz  [OSC-SMD_4P-L3.2-W2.5-BL]  42.84 28.33 180 top
X3  32.768kHz  [FC-135R_L3.2-W1.5]  35.55 32.19 180 top

## Footprints (pads in the part's own frame, mm; a bottom-side part is the same pattern mirrored in y, then rotated)
C0603
  rect 0.8x0.9 smd: 1(-0.7,0) 2(0.7,0)
CAP-SMD_BD6.3-L6.6-W6.6-LS7.3-FD
  rect 3.5x1.2 smd: 1(-2.67,0) 2(2.67,0)
CAP-SMD_BD6.3-L6.6-W6.6-LS7.6-FD
  rect 3.5x1.199 smd: 1(-2.67,0) 2(2.67,0)
CONN-SMD_PH2.0-4PWB
  rect 0.899x2.999 smd: 1(-2.999,-3.175) 2(-1.001,-3.175) 3(1.001,-3.175) 4(2.999,-3.175)
  rect 1.1x2.999 smd: 5(5.25,3.175) 6(-5.25,3.175)
CONN-TH_P5.08_KF127-5.08-2P
  round 2.401 hole 1.6: 1(-2.54,0) 2(2.54,0)
CONN-TH_XH-6AW
  round 1.801 hole 1.199: 1(6.251,0) 2(3.749,0) 3(1.25,0) 4(-1.25,0) 5(-3.749,0) 6(-6.251,0)
CONN-TH_XT30U-M
  round 3.8 hole 2.54: 1(-2.5,0) 2(2.5,0)
CONN-TH_XT30UPB-F
  round 4 hole 2.6: 1(-2.5,0) 2(2.5,0)
FC-135R_L3.2-W1.5
  rect 1.001x1.801 smd: 1(-1.25,0) 2(1.25,0)
HDR-TH_4P-P2.54-V-M
  rect 1.7x1.7 hole 1.1: 1(-3.81,0)
  round 1.7 hole 1.1: 2(-1.27,0) 3(1.27,0) 4(3.81,0)
HDR-TH_6P-P2.54-V-F-R2-C3-S2.54
  rect 1.7x1.6 hole 1: 1(-2.54,-1.27)
  round 1.6 hole 1: 2(-2.54,1.27) 3(0,-1.27) 4(0,1.27) 5(2.54,-1.27) 6(2.54,1.27)
HDR-TH_8P-P2.54-V-M
  rect 1.5x1.5 hole 1: 1(-8.89,0)
  round 1.5 hole 1: 2(-6.35,0) 3(-3.81,0) 4(-1.27,0) 5(1.27,0) 6(3.81,0) 7(6.35,0) 8(8.89,0)
HDR-TH_10P-P2.54-V-M-1
  rect 1.575x1.7 hole 1.1: 1(-11.43,0)
  round 1.7 hole 1.1: 2(-8.89,0) 3(-6.35,0) 4(-3.81,0) 5(-1.27,0) 6(1.27,0) 7(3.81,0) 8(6.35,0) 9(8.89,0) 10(11.43,0)
HSOP-8_L5.0-W4.0-P1.27-LS6.2-BL-EP
  oval 0.574x2.037 smd: 1(-1.905,-2.768) 2(-0.635,-2.768) 3(0.635,-2.768) 4(1.905,-2.768) 5(1.905,2.768) 6(0.635,2.768) 7(-0.635,2.768) 8(-1.905,2.768)
  rect 3.2x2.401 smd: 9(0,0)
IND-SMD_L5.8-W5.2_CD54T125NP-100MC
  rect 3.2x5.8 smd: 1(-1.95,0) 2(1.95,0)
LED0805-RD_RED
  rect 1x1.25 smd: 1(-1.1,0) 2(1.1,0)
LQFP-64_L10.0-W10.0-P0.50-LS12.0-BL
  oval 0.3x2 smd: 1(-3.75,-5.75) 2(-3.25,-5.75) 3(-2.75,-5.75) 4(-2.25,-5.75) 5(-1.75,-5.75) 6(-1.25,-5.75) 7(-0.75,-5.75) 8(-0.25,-5.75) 9(0.25,-5.75) 10(0.75,-5.75) 11(1.25,-5.75) 12(1.75,-5.75) 13(2.25,-5.75) 14(2.75,-5.75) 15(3.25,-5.75) 16(3.75,-5.75) 33(3.75,5.75) 34(3.25,5.75) 35(2.75,5.75) 36(2.25,5.75) 37(1.75,5.75) 38(1.25,5.75) 39(0.75,5.75) 40(0.25,5.75) 41(-0.25,5.75) 42(-0.75,5.75) 43(-1.25,5.75) 44(-1.75,5.75) 45(-2.25,5.75) 46(-2.75,5.75) 47(-3.25,5.75) 48(-3.75,5.75)
  oval 2x0.3 smd: 17(5.75,-3.75) 18(5.75,-3.25) 19(5.75,-2.75) 20(5.75,-2.25) 21(5.75,-1.75) 22(5.75,-1.25) 23(5.75,-0.75) 24(5.75,-0.25) 25(5.75,0.25) 26(5.75,0.75) 27(5.75,1.25) 28(5.75,1.75) 29(5.75,2.25) 30(5.75,2.75) 31(5.75,3.25) 32(5.75,3.75) 49(-5.75,3.75) 50(-5.75,3.25) 51(-5.75,2.75) 52(-5.75,2.25) 53(-5.75,1.75) 54(-5.75,1.25) 55(-5.75,0.75) 56(-5.75,0.25) 57(-5.75,-0.25) 58(-5.75,-0.75) 59(-5.75,-1.25) 60(-5.75,-1.75) 61(-5.75,-2.25) 62(-5.75,-2.75) 63(-5.75,-3.25) 64(-5.75,-3.75)
OSC-SMD_4P-L3.2-W2.5-BL
  rect 1.4x1.2 smd: 1(-1.1,-0.875) 2(1.1,-0.875) 3(1.1,0.875) 4(-1.1,0.875)
Pad_e2
  round 4 hole 3: 1(0,0)
Pad_e4
  round 4 hole 3: 2(0,0)
Pad_e5
  round 4 hole 3: 3(0,0)
Pad_e6
  round 4 hole 3: 4(0,0)
R0603
  rect 0.806x0.864 smd: 1(-0.753,0) 2(0.753,0)
R0805
  rect 1.133x1.377 smd: 1(-1,0) 2(1,0)
R1206
  rect 1.208x1.701 smd: 1(-1.479,0) 2(1.479,0)
SMA_L4.4-W2.8-LS5.4-RD
  rect 2.046x1.62 smd: 1(-2.566,0) 2(2.566,0)
SOIC-8_L5.0-W4.0-P1.27-LS6.0-BL
  oval 0.569x1.95 smd: 1(-1.905,-2.705) 2(-0.635,-2.705) 3(0.635,-2.705) 4(1.905,-2.705) 5(1.905,2.705) 6(0.635,2.705) 7(-0.635,2.705) 8(-1.905,2.705)
SOT-223_L6.5-W3.5-P2.30-LS7.0-BR
  rect 2.465x1.05 smd: 1(2.857,-2.3) 2(2.857,0) 3(2.857,2.3)
  rect 2.465x3.54 smd: 4(-2.857,0)
SW-SMD_6P-L7.0-W7.0-P1.40-LS7.4
  rect 1.5x1 smd: 1(-3.25,1.4) 2(-3.25,0) 3(-3.25,-1.4) 4(3.25,-1.4) 5(3.25,0) 6(3.25,1.4)
SW-SMD_6P-L7.6-W6.3-P2.54-LS9.8
  rect 1.1x1.501 smd: 1(-2.54,-4.501) 2(0,-4.501) 3(2.54,-4.501) 4(2.54,4.501) 5(0,4.501) 6(-2.54,4.501)
SW-SMD_L4.0-W2.9-LS5.0
  rect 1.53x1.36 smd: 1(-2.035,0) 2(2.035,0)
SW-TH_SS-12F23-G040
  rect 1.801x2.251 hole 1.25: 1(-2.999,0.099)
  round 2.251 hole 1.25: 2(0,0.099) 3(2.999,0.099) 4(6.401,-0.099) 5(-6.401,-0.099)

## Nets
As in the schematic, except:
BOOT1: H1.3 U1.27

Pads without a net: CN1 5 6; CN4 5 6; H8 5 6 7 8 9; NOREF 3; NOREF#2 4; NOREF#3 2; NOREF#4 1; U1 11 28 34 35 36 45; U9 5; U10 3 4 5; X2 2 4

## Via types
v1: diameter 0.61, hole 0.305, Top Layer to Bottom Layer, 257 vias
v2: diameter 1.016, hole 0.762, Top Layer to Bottom Layer, 14 vias
v3: diameter 1.27, hole 1.016, Top Layer to Bottom Layer, 4 vias

## Routing (per net, layer and track width the routed paths; a pad name or vN(x,y) marks a point on that pad's centre or on a via; arc(x,y) is an arc through that point)
+5V: length 326.2
  Top Layer w0.508: v1(33.15,46.23) 26.29,53.09 v1(25.91,53.09) 25.86,53.13 R7.1 ; U7.3 56.26,18.8 v1(56.39,18.92) ; 51.56,50.67 51.56,51.69 51.31,51.94 48.13,51.94 46.7,53.37 46.68,53.37 46.44,53.61 46.44,53.64 C26.1 45.85,57.23 CN1.1 ; 51.56,50.67 U9.3 ; 51.56,50.67 52.45,51.56 53.85,50.16 53.85,45.59 v1(56.71,42.73) R4.1 ; 40.17,15.84 39.18,14.85 C20.2 ; R1.1 56.52,27.69 v1(56.39,27.69) ; R10.1 28.8,35.28 v1(29.72,36.19)
  Top Layer w0.762: 48.77,14.31 48.22,14.86 41.15,14.86 39.12,16.89 39.12,20.45 v1(37.81,21.76) 37.46,22.1 C23.1 35.95,21.48 U8.3 ; 48.77,14.31 48.77,12.45 C21.1 ; 48.77,14.31 L2.1
  Top Layer w1.016: U7.3 52.45,18.8 51.73,18.07 L2.1
  Bottom Layer w0.381: v1(33.15,46.23) 34.49,44.88 34.49,42.12 33.78,41.41 33.78,38.89 34.7,37.97 38.76,37.97 39.27,38.48 41.15,38.48 41.53,38.1 41.53,37.97 43.43,36.07 43.43,32.77 37.81,27.14 v1(37.81,21.76)
  Bottom Layer w0.508: H5.2 4.44,42.22 4.44,38.53 ; v1(33.15,46.23) 31.75,44.83 31.75,38.23 v1(29.72,36.19) ; H6.2 6.16,24.57 4.44,26.29 4.44,38.53 ; v1(25.91,53.09) 25.91,52.2 24.04,50.33 24.04,48.47 19.3,43.73 19.3,35.43 17.27,33.4 12.06,33.4 6.94,38.53 4.44,38.53 ; v1(56.71,42.73) 56.71,28.01 v1(56.39,27.69) v1(56.39,18.92) 56.39,18.8 55.24,17.65 55.13,17.76 53.83,17.76 45.21,9.14 40.9,9.14 40.13,8.37 40.13,5.21 40.77,4.57 56.52,4.57 58.16,6.21 58.16,9.9 69.98,21.72 73.77,21.72 75.69,23.64 75.69,31.94 H3.2 74.49,34.74 76.2,36.45 76.2,51.63 H4.2
+12V: length 24.8
  Top Layer w1.016: 63.76,21.84 63.7,21.91 ; 63.76,21.84 62.48,21.84 ; 63.76,21.84 C25.1 ; D2.1 60.48,13.33 62.48,15.34 62.48,21.84 ; 62.48,21.84 61.34,21.84 59.63,23.56 C19.2 54.36,21.63 U7.1
GND: length 28.3
  Top Layer w0.254: v1(42.16,38.61) 41.78,38.99 39.98,38.99 39.14,38.15 37.22,38.15 36.84,38.53 U1.63 34.35,38.53 33.7,39.18 C14.1 ; C17.1 49.98,37.53 48.97,38.53 U1.18 ; C15.1 37.48,49.73 38.28,48.93 U1.47 ; U1.31 50.02,45.03 C16.1 ; C18.1 43.28,34.07 U1.12 43.28,37.49 v1(43.18,37.59) ; 21.56,29.41 22.96,28 U5.1
  Bottom Layer w0.254: v1(43.18,37.59) v1(42.16,38.61)
  vias: v1(2.16,55.37) v1(2.16,53.78) v1(2.16,52.14) v1(2.16,50.55) v1(2.16,48.96) v1(2.16,47.37) v1(2.16,45.53) v1(2.16,43.94) v1(2.16,41.85) v1(2.16,40.26) v1(2.16,37.34) v1(2.16,35.75) v1(2.16,34.1) v1(2.16,32.51) v1(2.16,30.93) v1(2.16,29.34) v1(2.16,27.5) v1(2.16,25.91) v1(2.16,23.81) v1(2.16,22.22) v1(6.35,40.83) v1(6.35,39.62) v1(7.87,40.89) v1(7.87,39.62) v1(9.14,2.41) v1(9.14,1.02) v1(9.19,40.89) v1(9.19,39.62) v1(9.19,38.25) v1(9.4,18.29) v1(9.4,16.82) v1(10.8,18.29) v1(10.8,16.58) v1(10.8,2.41) v1(10.78,1.02) v1(11.05,62.23) v1(12.34,1.02) v1(12.37,2.41) v1(14.25,2.41) v1(14.28,1.02) v1(14.8,22.94) v1(14.86,62.1) v1(16.42,23.04) v1(18.03,39.88) v1(18.03,38.48) v1(19.69,23.88) v1(23.24,44.45) v1(23.24,43.32) v1(23.24,42.17) v1(24.51,44.45) v1(26.54,9.78) v1(26.54,8) v1(26.54,5.97) v1(28.45,9.78) v1(28.5,8) v1(28.48,5.97) v1(30.1,3.94) v1(32.26,3.94) v1(34.37,3.94) v1(36.45,13.08) v1(36.37,3.94) v1(36.83,55.12) v1(37.21,12.06) v1(37.46,54.61) v1(37.85,13.08) v1(38.99,29.72) v1(38.99,10.79) v1(40.64,10.79) v1(41.53,55.75) v1(41.53,54.36) v1(41.67,20.19) v1(43,55.75) v1(43.04,54.36) v1(43.05,20.19) v1(44.58,20.19) v1(44.58,19.02) v1(44.58,17.78) v1(45.47,49.15) v1(45.47,43.31) v1(45.47,42.4) v1(46.23,24.77) v1(46.36,49.15) v1(47.88,26.28) v1(47.88,24.77) v1(49.4,26.28) v1(49.4,24.77) v1(50.04,34.15) v1(50.93,27.56) v1(50.9,26.29) v1(50.93,24.77) v1(52.07,14.2) v1(52.07,13.08) v1(52.45,26.29) v1(52.45,24.77) v1(55.5,41.27) v1(55.88,37.46) v1(56.52,57.66) v1(56.52,56.01) v1(56.64,11.38) v1(58.29,57.66) v1(58.33,56.01) v1(60.45,43.62) v1(60.45,42.4) v1(60.45,41.01) v1(60.45,40) v1(64.14,52.83) v1(64.31,11.38) v1(65.02,53.85) v1(65.91,12.57) v1(65.89,11.38) v1(67.58,16.79) v1(67.58,15.33) v1(67.58,13.84) v1(67.58,12.57) v1(69.21,16.79) v1(69.21,15.25) v1(69.21,13.84) v1(69.21,12.57) v1(72.39,41.15) v1(72.39,39.88) v1(73.91,41.15) v1(73.91,39.88) v1(78.74,38.48) v1(78.74,36.89) v1(78.74,35.24) v1(78.74,33.65) v1(78.74,32.07) v1(78.74,30.48) v1(78.74,28.64) v1(78.74,27.05) v1(78.74,24.96) v1(78.74,23.37) v1(78.87,58.93) v1(78.87,57.34) v1(78.87,55.69) v1(78.87,54.1) v1(78.87,52.52) v1(78.87,50.93) v1(78.87,49.09) v1(78.87,47.5) v1(78.87,45.4) v1(78.87,43.81)
VCC: length 261
  Top Layer w0.254: 45.33,38.99 44.83,38.99 44.15,38.31 ; 45.33,38.99 47.23,38.99 U1.19 50,39.03 ; 45.33,38.99 45.33,40.01 v1(45.08,40.26) ; 50.04,38.99 C17.2 ; C14.2 33.97,37.78 34.16,37.97 35.72,37.97 U1.64 36.07,37.74 39.36,37.74 40.1,38.48 41.34,38.48 41.97,37.85 42.55,37.85 43.05,38.35 44.11,38.35 44.15,38.31 ; 44.15,38.31 43.78,37.94 U1.13 43.78,33.38 C18.2 ; v1(41.15,44.96) 40.39,45.72 38.1,45.72 37.78,46.04 U1.48 37.78,47.69 36,49.47 C15.2 ; C16.2 49.4,45.53 U1.32
  Top Layer w0.508: C24.2 26.16,18.73 U8.4 U8.2 v1(33.65,19.18) ; C24.2 25.99,14.31 R23.1 22.42,14.19 R22.1 19.74,14.32 R21.1 17.24,14.1 v1(9.91,14.1) ; C24.2 26.16,12.32 26.67,11.81 27.18,11.81 28.96,13.59 33.4,13.59 36.27,10.72 36.27,8.13 ; C16.2 52.13,46.29 56.52,41.91 56.52,40.64 56.13,40.26 ; R2.1 59.7,26.3 v1(60.96,27.56) ; R5.1 v1(58.17,40.78) 57.65,40.26 56.13,40.26 ; C15.2 36,52.77 v1(34.29,54.48) ; H2.1 9.79,61.46 R17.2 9.79,58.16 11.05,56.9 19.69,56.9 21.97,54.61 v1(22.1,54.61) 22.1,53.37 R8.1 ; v1(40.51,58.04) H8.1 43.18,61.47 57.28,61.47 H7.2 ; R14.2 13,21.51 v1(12.83,21.34) ; R11.1 21.44,36.3 22.35,37.21 31.94,37.21 C14.2 32.51,36.85 R15.2 32.91,34.92 29.38,34.92 29.38,27.62 R18.2 32.66,25.89 v1(33.27,25.27) ; 56.13,40.26 54.8,38.93 52.25,38.93 52.11,38.79 50.18,38.79 C17.2
  Bottom Layer w0.508: v1(12.83,21.34) 12.83,16.26 10.67,14.1 v1(9.91,14.1) 8,12.19 8,10.54 H1.1 H1.2 ; v1(33.65,19.18) 33.65,24.89 v1(33.27,25.27) ; v1(41.15,44.96) 45.08,41.02 v1(45.08,40.26) ; v1(40.51,58.04) 37.85,58.04 v1(34.29,54.48) 34.16,54.61 v1(22.1,54.61) ; v1(60.96,27.56) 58.17,30.35 58.17,30.44 57.66,30.95 57.66,40.27 v1(58.17,40.78)
BOOT0: length 55.5
  Top Layer w0.254: H1.4 4.32,11.94 4.32,14.99 v1(6.1,16.76) ; U1.60 34.35,40.03 34.19,39.88 31.75,39.88 30.99,39.12 30.99,38.86 ; v1(30.99,38.78) 30.69,38.48 v1(20.95,38.48)
  Bottom Layer w0.254: v1(20.95,38.48) 19.94,37.46 19.94,28.96 20.19,28.7 20.94,28.7 21.34,28.3 21.34,26.67 19.05,24.38 13.72,24.38 v1(6.1,16.76)
BOOT1: length 76.6
  Top Layer w0.254: v1(54.74,40.51) 51.56,43.69 49.28,43.69 48.62,43.03 U1.27 ; H1.3 8,13.08 8,14.1 8.89,14.99 v1(8.89,15.24) 19.18,15.24 22.86,18.92 22.86,21.08 23.24,21.46 27.69,21.46 28.45,22.22 28.45,22.73 28.58,22.86 34.42,22.86 36.07,24.51 40.66,24.51 42.18,26.03 46.42,26.03 50.42,30.03 50.42,32.77 v1(54.86,37.21)
  Bottom Layer w0.254: v1(54.86,37.21) 54.86,40.39 v1(54.74,40.51)
CAN_RX: length 22.3
  Top Layer w0.254: v1(37.85,39.5) 37.81,39.53 U1.61 ; U9.4 52.83,47.58 52.5,47.24 49.52,47.24 48.88,46.61 46.42,46.61 45.38,45.57 44.17,45.57 40.13,41.53 40.13,40.64 v1(39.24,39.75)
  Bottom Layer w0.254: v1(37.85,39.5) 38.99,39.5 v1(39.24,39.75)
CAN_TX: length 19.4
  Top Layer w0.254: U1.62 37.17,39.03 v1(37.46,38.73) 38.1,38.73 38.48,39.12 38.48,40.9 43.56,45.97 45.21,45.97 46.61,47.37 48.77,47.37 49.02,47.62 U9.1
CANH: length 12.8
  Top Layer w0.254: R19.2 54.48,59.18 53.06,60.61 51.34,60.61 50.15,59.42 CN1.3 50.29,57.39 U9.7
CANL: length 6.6
  Top Layer w0.254: R19.1 54.3,55.38 CN1.4 52.15,54.98 U9.6
I2C2_SCL: length 35.6
  Top Layer w0.254: 30.73,55.62 30.73,53.09 34.54,49.28 v1(34.54,48.13) ; 35.43,64.13 35.56,64.01 v1(35.56,57.91) ; v1(44.7,44.45) 45.12,44.03 U1.29
  Bottom Layer w0.254: v1(35.56,57.91) 33.27,55.63 v1(30.73,55.63) ; v1(44.7,44.45) 42.67,46.48 36.2,46.48 v1(34.54,48.13)
I2C2_SDA: length 31.4
  Top Layer w0.254: v1(33.15,58.42) 33.15,63.88 H8.4 ; v1(31.75,56.64) 31.75,53.85 35.18,50.42 v1(35.18,48.64) ; U1.30 45.89,44.53 v1(45.59,44.83)
  Bottom Layer w0.254: v1(31.75,56.64) 33.15,58.04 v1(33.15,58.42) ; v1(45.59,44.83) 43.43,46.99 36.83,46.99 v1(35.18,48.64)
KEY1: length 52.7
  Top Layer w0.254: 8.81,8.26 v1(8.81,11.38) 8.64,11.56 ; U1.54 34.52,43.03 34.52,42.73 34.5,42.71 34.5,42.5 34.16,42.16 25.15,42.16 v1(24.89,42.42)
  Bottom Layer w0.254: v1(24.89,42.42) 23.24,40.77 23.24,25.8 v1(8.81,11.38)
KEY2: length 54.6
  Top Layer w0.254: SW7.2 10,6.86 10.41,7.28 10.41,11.3 10.16,11.56 ; v1(25.78,43.18) 25.91,43.05 33.65,43.05 34.14,43.53 U1.53
  Bottom Layer w0.254: v1(10.35,11.38) 23.83,24.86 23.83,40.34 25.65,42.16 25.65,43.05 v1(25.78,43.18)
KEY3: length 56.1
  Top Layer w0.254: SW7.3 9.9,5.46 11.3,6.86 10.92,7.24 10.92,10.79 11.3,11.18 11.68,11.18 v1(12.06,11.56) ; v1(26.54,43.69) 26.67,43.81 33.71,43.81 33.93,44.03 U1.52
  Bottom Layer w0.254: v1(12.06,11.56) 24.26,23.75 24.26,39.62 26.54,41.91 v1(26.54,43.69)
KEY4: length 51.7
  Top Layer w0.254: U1.51 33.45,44.53 33.4,44.58 v1(27.43,44.58) ; 15.31,8.26 13.59,9.98 v1(13.59,10.92)
  Bottom Layer w0.254: v1(27.43,44.58) 27.43,41.91 24.66,39.14 24.66,28.8 25.4,28.07 25.4,23.49 13.59,11.68 v1(13.59,10.92)
KEY5: length 68.2
  Top Layer w0.254: v1(15.37,11.18) 16.89,9.65 16.89,5.85 16.5,5.46 SW7.4 ; v1(45.85,48.01) 45.85,47.62 45.75,47.53 U1.33
  Bottom Layer w0.254: 38.46,48.67 38.48,48.67 ; 38.46,48.67 37.46,49.66 37.08,49.66 36.7,50.04 33.78,50.04 30.48,46.74 30.48,40.39 28.32,38.23 28.32,25.4 15.37,12.45 v1(15.37,11.18) ; 38.46,48.67 38.99,48.13 45.97,48.13
LED: length 9.6
  Top Layer w0.254: U1.2 38.28,34.6 37.97,34.29 33.68,34.29 LED1.1
MOTOR1_1: length 16.3
  Top Layer w1.016: U2.6 63.82,31.05 65.15,29.72 65.15,25.53 65.94,24.74 H3.6
MOTOR1_2: length 14.1
  Top Layer w1.016: U2.8 63.56,33.59 64.39,34.42 64.39,36.83 64.8,37.24 H3.1
MOTOR2_1: length 18.3
  Top Layer w1.016: H4.6 72.9,44.32 68.58,40 66.17,40 65.15,41.02 65.15,45.34 63.97,46.52 U3.6
MOTOR2_2: length 15
  Top Layer w1.016: H4.1 71.02,57.43 65.02,51.43 65.02,49.93 64.15,49.06 U3.8
MOTOR3_1: length 15.9
  Top Layer w1.016: H5.6 7.59,55.37 13.97,55.37 16,53.34 16,50.29 17.65,48.64 U4.6
MOTOR3_2: length 13.4
  Top Layer w1.016: U4.8 18.68,45.97 16.64,45.97 16.13,45.47 16.13,44.2 14.7,42.77 H5.1
MOTOR4_1: length 17.2
  Top Layer w1.016: 18.29,30.54 16.45,30.54 16,30.99 16,35.56 14.48,37.08 10,37.08 H6.6
MOTOR4_2: length 14.7
  Top Layer w1.016: H6.1 8.86,22.07 10.8,24 14.86,24 15.75,24.89 15.75,27.43 16.32,28 U5.8
MOTOR_POWER: length 190.8
  Top Layer w0.508: R20.2 54.08,11.73
  Top Layer w1.016: v3(62.99,40.39) C3.2 62.99,44.46 U3.5 ; U5.5 17.71,32.38 C7.2 17.71,36.89 v3(17.65,36.96) ; C8.1 v2(13.37,35.27) 13.33,35.31 ; U2.5 63.18,28.3 C1.2 v3(63.18,24.7) 63.25,24.64 ; C6.1 v2(13.59,53.47) ; v2(66.93,26.29) 66.87,26.35 C2.1 ; U4.5 18.16,50.55 C5.2 18.16,52.96 v3(18.16,54.74) ; v2(67.06,41.53) 67.11,41.59 C4.1
  Top Layer w2.032: D2.2 54.08,12.06 v2(53.12,11.11) v2(51.92,9.91) 46.99,9.91 45.51,8.43 45.51,7.08
  Bottom Layer w1.016: 14.6,55.75 15.16,55.75 ; 14.6,55.75 18.41,59.56 61.47,59.56 67.06,53.97 v2(67.06,41.53) 66.93,41.4 ; 14.6,55.75 13.59,54.74 v2(13.59,53.47) ; 15.16,55.75 17.14,55.75 v3(18.16,54.74) ; 15.16,55.75 15.16,37.84 15.53,37.46 ; v2(13.37,35.27) 13.37,36.48 14.35,37.46 15.53,37.46 ; 66.93,41.4 65.91,40.39 v3(62.99,40.39) ; 66.93,41.4 v2(66.93,26.29) 65.34,24.7 v3(63.18,24.7) 63.18,21.17 v2(53.12,11.11) v2(51.92,9.91) ; v3(17.65,36.96) 17.14,37.46 15.53,37.46
NRST: length 39.9
  Top Layer w0.254: v1(17.73,23.04) C13.1 R14.1 15.55,17.97 KEY1.1 ; v1(17.73,23.04) 17.65,23.11 ; v1(17.73,23.04) 21.14,23.04 22.48,24.38 22.48,24.46 22.59,24.57 22.59,25.18 23.06,25.65 25.02,25.65 27.18,23.49 v1(28.32,23.49) ; 40.77,36.02 U1.7 40.78,33.9 v1(40.89,33.78)
  Bottom Layer w0.254: v1(28.32,23.49) 37.08,32.26 39.37,32.26 v1(40.89,33.78)
OSC32_IN: length 9.4
  Top Layer w0.254: C12.1 34.3,30.33 X3.2 35.76,33.65 38.1,33.65 38.73,34.29 38.73,35.99 U1.3
OSC32_OUT: length 7.6
  Top Layer w0.254: C11.2 36.44,31.83 X3.1 37.4,32.19 39.34,34.14 39.34,35.97 U1.4
OSC_IN: length 11.5
  Top Layer w0.254: U1.5 39.75,36.01 39.75,33.92 39.62,33.8 39.62,32.64 40.39,31.88 C9.2 ; C9.2 40.39,28.82 X2.3 ; C9.2 R13.2
OSC_OUT: length 11.8
  Top Layer w0.254: X2.1 43.94,31.35 43.92,31.37 ; 43.92,31.37 45.85,31.37 C10.2 ; 43.92,31.37 43.92,31.51 42.93,32.51 40.77,32.51 40.13,33.15 40.13,33.71 40.26,33.84 40.26,36.01 U1.6
POWER: length 36.1
  Top Layer w2.032: CN2.1 72.77,17.35 CN3.1 67.18,9.91 61.59,4.32 49.78,4.32 48.51,5.59 48.51,7.08
PWM1_1: length 30
  Top Layer w0.254: v1(53.59,30.99) 56.1,30.99 U2.3 ; U1.37 43.28,48.73 43.7,49.15 v1(44.32,49.15)
  Bottom Layer w0.254: v1(44.32,49.15) 45.21,50.04 46.64,50.04 47.05,49.62 47.12,49.62 47.12,41.02 49.78,38.35 50.42,38.35 52.83,35.94 52.83,31.75 v1(53.59,30.99)
PWM1_2: length 30.6
  Top Layer w0.254: v1(44.07,50.04) 44.02,50.04 42.8,48.82 42.8,47.55 U1.38 ; U2.2 56.1,32.38 v1(53.72,32.38)
  Bottom Layer w0.254: v1(44.07,50.04) 44.7,50.67 47.5,50.67 48.26,49.91 48.26,41.02 50.04,39.24 50.93,39.24 53.72,36.45 v1(53.72,32.38)
PWM2_1: length 18.9
  Top Layer w0.254: U1.39 42.28,48.56 42.34,48.62 42.34,48.94 42.93,49.52 v1(42.93,49.91) ; U3.3 56.45,46.74 54.99,46.74 v1(54.74,46.99)
  Bottom Layer w0.254: v1(54.74,46.99) 50.42,51.31 44.32,51.31 v1(42.93,49.91)
PWM2_2: length 20.6
  Top Layer w0.254: U3.2 56.57,47.88 v1(54.86,47.88) ; U1.40 41.78,48.64 41.94,48.79 41.94,49.11 42.29,49.46 v1(42.29,50.55)
  Bottom Layer w0.254: v1(42.29,50.55) 42.29,51.18 43.43,52.32 50.42,52.32 v1(54.86,47.88)
PWM3_1: length 26.1
  Top Layer w0.254: U1.41 41.28,48.71 41.53,48.96 v1(41.53,49.78) ; U4.3 26.67,48.64
  Bottom Layer w0.254: v1(26.54,48.64) 26.54,49.66 30.61,53.72 41.15,53.72 41.53,53.34 v1(41.53,49.78)
PWM3_2: length 23.7
  Top Layer w0.254: U1.42 40.78,49.16 v1(40.89,49.28) ; U4.2 v1(26.67,47.37)
  Bottom Layer w0.254: v1(26.67,47.37) 27.18,47.37 32.77,52.96 39.88,52.96 40.89,51.94 v1(40.89,49.28)
PWM4_1: length 37.4
  Top Layer w0.254: 25.91,30.48 v1(25.85,30.54) 23.82,30.54 ; U1.43 40.28,50.14 v1(40.26,50.16)
  Bottom Layer w0.254: v1(25.85,30.54) 25.85,38.93 28.19,41.27 28.19,47.62 32.39,51.82 38.73,51.82 40.26,50.29 v1(40.26,50.16)
PWM4_2: length 35.9
  Top Layer w0.254: v1(39.62,49.15) 39.78,48.99 U1.44 ; U5.2 v1(25.72,29.27)
  Bottom Layer w0.254: v1(39.62,49.15) 39.5,49.28 39.5,49.78 38.23,51.05 33.27,51.05 29.59,47.37 29.59,40.61 26.8,37.82 26.8,30.35 v1(25.72,29.27)
SPI1_BLK: length 39.9
  Top Layer w0.254: v1(49.53,43.05) 49.01,42.53 U1.26 ; v1(57.4,53.59) 63.12,53.59 69.09,59.56 70.61,59.56 H7.8
  Bottom Layer w0.254: v1(57.4,53.59) 57.4,50.8 56.13,49.53 56.13,46.86 55.63,46.35 53.85,46.35 50.55,43.05 v1(49.53,43.05)
SPI1_CLK: length 34.5
  Top Layer w0.254: v1(51.56,40.26) 51.18,40.26 50.95,40.03 U1.21 ; v1(61.09,57.4) 62.36,58.67 H7.3
  Bottom Layer w0.254: v1(51.56,40.26) 55.5,44.2 58.67,44.2 61.09,46.61 v1(61.09,57.4)
SPI1_CS: length 38.1
  Top Layer w0.254: v1(58.42,54.48) 62.86,54.48 72.39,64.01 H7.7 ; U1.25 49.65,42.03 v1(49.78,42.16)
  Bottom Layer w0.254: v1(58.42,54.48) 58.42,50.8 56.77,49.15 56.77,46.48 56.13,45.85 54.23,45.85 50.55,42.16 v1(49.78,42.16)
SPI1_DC: length 37
  Top Layer w0.254: v1(59.31,55.37) 62.61,55.37 69.98,62.74 H7.6 ; U1.24 50.8,41.53 v1(51.18,41.91)
  Bottom Layer w0.254: v1(59.31,55.37) 59.31,50.8 57.42,48.91 57.42,46.24 56.52,45.34 54.61,45.34 v1(51.18,41.91)
SPI1_MOSI: length 34.9
  Top Layer w0.254: U1.23 50.28,41.03 v1(50.55,40.77) ; 64.9,64.01 64.26,63.37 64.26,59.31 61.72,56.77 v1(59.94,56.77)
  Bottom Layer w0.254: v1(50.55,40.77) 51.05,40.77 55,44.71 56.78,44.71 57.98,45.91 57.98,48.45 59.94,50.42 v1(59.94,56.77)
SPI1_RST: length 37.5
  Top Layer w0.254: v1(51.82,39.5) 51.69,39.62 48.82,39.62 48.73,39.53 U1.20 ; v1(62.1,56.13) 67.44,61.47 H7.5
  Bottom Layer w0.254: v1(62.1,56.13) 62.1,52.45 61.85,52.2 61.85,51.15 61.64,50.94 61.64,46.02 59.31,43.69 56.39,43.69 52.2,39.5 v1(51.82,39.5)
SW_1: length 41.1
  Top Layer w0.254: v1(40.77,37.72) 41.28,37.21 U1.8 ; R21.2 v1(18.71,11.55) 19.05,11.21 SW2.6
  Bottom Layer w0.254: v1(18.71,11.55) 26.03,18.87 26.03,22.22 38.48,34.67 38.48,36.07 39.83,37.42 40.46,37.42 v1(40.77,37.72)
SW_2: length 38.2
  Top Layer w0.254: R22.2 v1(21.05,11.5) 21.59,10.96 SW2.5 ; v1(41.78,34.42) 41.78,36.03 U1.9
  Bottom Layer w0.254: v1(21.05,11.5) 27.3,17.75 27.3,21.46 37.58,31.74 40.37,31.74 41.78,33.15 v1(41.78,34.42)
SW_3: length 37.4
  Top Layer w0.254: v1(42.55,34.42) 42.55,34.6 42.29,34.85 42.29,36.02 U1.10 ; R23.2 v1(23.68,11.65) 24.13,11.21 SW2.4
  Bottom Layer w0.254: v1(42.55,34.42) 42.55,32.89 40.64,30.99 37.97,30.99 29.21,22.22 29.21,17.18 v1(23.68,11.65)
SWCLK: length 33.5
  Top Layer w0.254: U1.49 23.35,57.96 14.68,57.96 13.34,59.3 R16.2 13.34,62.75 H2.4
SWDIO: length 41.9
  Top Layer w0.254: 11.81,58.8 v1(11.53,59.08) 11.29,59.32 R17.1 12.19,61.73 H2.3 ; U1.46 v1(38.78,49.61) 38.78,54.31 36.34,56.75 33.42,56.75 31.75,58.42 15.49,58.42 v1(15.37,58.55)
  Bottom Layer w0.254: v1(11.53,59.08) 12.06,58.55 v1(15.37,58.55)
TIM2_CH1: length 54.7
  Top Layer w0.254: v1(37.97,44.96) 37.9,45.03 U1.50 ; v1(68.71,38.99) 55.62,38.99 55.02,38.39 53.38,38.39 v1(51.31,36.32)
  Bottom Layer w0.254: H4.3 72.16,51.69 69.21,51.69 68.71,51.18 v1(68.71,38.99) ; v1(37.97,44.96) 39.24,44.96 48.01,36.19 51.26,36.19 51.31,36.25 v1(51.31,36.32)
TIM2_CH2: length 52.5
  Top Layer w0.254: v1(69.72,39.37) 69.72,39.18 68.95,38.4 55.61,38.4 55.19,37.99 53.86,37.99 v1(51.31,35.43) ; U1.55 v1(37.96,42.53) 37.97,42.54
  Bottom Layer w0.254: v1(37.96,42.53) 41.03,42.53 48.13,35.43 v1(51.31,35.43) ; H4.4 69.87,49.93 69.72,49.78 v1(69.72,39.37) 69.6,39.24
TIM3_CH1: length 52.1
  Top Layer w0.254: U1.56 37.34,42.03 v1(37.59,41.78) ; v1(54.1,28.45) 54.23,28.32 54.23,27.54 54.77,27 55.55,27 57.4,25.15 61.21,25.15 62.86,23.49 v1(69.72,23.49)
  Bottom Layer w0.254: v1(37.59,41.78) 40.77,41.78 v1(54.1,28.45) ; v1(69.72,23.49) 69.72,29.06 H3.3
TIM3_CH2: length 51.5
  Top Layer w0.254: U1.57 36.91,41.53 37.42,41.02 v1(37.59,41.02) ; v1(70.99,23.37) 70.48,22.86 62.74,22.86 60.96,24.64 56.9,24.64 55.21,26.32 54.08,26.32 53.72,26.68 53.72,27.43 v1(53.47,27.69)
  Bottom Layer w0.254: v1(37.59,41.02) 40.7,41.02 52.45,29.27 52.45,28.07 52.83,27.69 v1(53.47,27.69) ; H3.4 70.99,27.83 v1(70.99,23.37)
TIM4_CH1: length 34.6
  Top Layer w0.254: v1(10.29,40.64) 11.65,40.64 12.28,41.27 33.91,41.27 34.15,41.03 U1.58
  Bottom Layer w0.254: H5.3 10.29,44.98 v1(10.29,40.64) 10.41,40.51 10.41,40.26
TIM4_CH2: length 36.2
  Top Layer w0.254: U1.59 35.76,40.51 33.78,40.51 33.53,40.77 12.57,40.77 v1(11.94,40.13)
  Bottom Layer w0.254: v1(11.94,40.13) 11.94,45.83 H5.4
TIM5_CH1: length 51.8
  Top Layer w0.254: v1(20.15,26.67) 20.28,26.8 26.54,26.8 29.72,23.62 34.42,23.62 ; v1(40.05,26.08) 38.01,26.08 37.21,25.27 36.07,25.27 34.42,23.62 ; v1(44.45,34.42) 44.28,34.59 U1.14 ; 34.42,23.62 34.29,23.75
  Bottom Layer w0.254: H6.3 11.2,27.07 14.9,30.77 15.71,30.77 19.81,26.67 v1(20.15,26.67) ; v1(40.05,26.08) 45.47,31.5 45.47,32.26 45.97,32.77 45.97,33.4 44.96,34.42 v1(44.45,34.42)
TIM5_CH2: length 48.2
  Top Layer w0.254: v1(39.12,27.18) 36.58,27.18 33.78,24.38 29.72,24.38 26.8,27.3 22.22,27.3 22,27.53 v1(20.64,27.53) ; v1(45.21,33.27) 45.08,33.4 45.08,34.69 44.85,34.92 44.85,35.96 U1.15
  Bottom Layer w0.254: H6.4 11.16,29.57 13.23,31.65 16.52,31.65 v1(20.64,27.53) ; v1(39.12,27.18) v1(45.21,33.27)
USART2_RX: length 39
  Top Layer w0.254: 30.27,8.13 30.35,8.21 v1(30.35,12.06) ; v1(46.86,32.64) 48.77,34.54 v1(48.77,37.08) 48.77,37.59 48.33,38.03 U1.17
  Bottom Layer w0.254: v1(30.35,12.06) 47.12,28.83 47.12,32.38 v1(46.86,32.64)
USART2_TX: length 36.2
  Top Layer w0.254: v1(32.26,12.19) 32.27,12.18 32.27,8.13 ; U1.16 45.28,35.11 v1(45.97,34.42)
  Bottom Layer w0.254: v1(32.26,12.19) 48.51,28.45 48.51,32.26 47.39,33.38 47.01,33.38 v1(45.97,34.42)
$1N7489: length 2.3
  Top Layer w0.254: R15.1 37.43,35.69 U1.1
$1N10210: length 2.3
  Top Layer w0.508: R18.1 31.23,27.51 LED1.2
$2N973: length 4.2
  Top Layer w0.254: R2.2 R1.2 56.16,29.55 U2.4
$2N1193: length 10.5
  Top Layer w1.016: 64.77,32.26 64.71,32.32 U2.7 ; R3.2 62.36,36.07
  Bottom Layer w1.016: v2(64.65,32.26) 64.65,35.04 64.14,35.56 62.75,35.56 v2(62.3,36.01)
$2N2351: length 3.9
  Top Layer w0.254: R5.2 59.17,43.29 R4.2 56.66,44.29 U3.4
$2N2356: length 9
  Top Layer w1.016: U3.7 64.86,47.79 64.9,47.75 ; R6.2 62.48,51.94 62.99,51.43
  Bottom Layer w1.016: v2(64.8,47.74) 64.8,49.51 v2(62.93,51.38)
$2N3284: length 3.7
  Top Layer w0.254: R8.2 R7.2 24.34,51.59 U4.4
$2N3289: length 7.4
  Top Layer w1.016: 17.53,43.94 18.63,43.94 R9.2 ; 18.8,47.37 16.64,47.37
  Bottom Layer w1.016: v2(17.47,43.88) 17.46,43.88 16.58,44.76 v2(16.58,47.31)
$2N4229: length 4.1
  Top Layer w0.254: R11.2 R10.2 23.82,33.36 U5.4
$2N4234: length 8.6
  Top Layer w1.016: R12.2 18.37,25.91 17.27,25.91 ; U5.7 18.22,29.34 15.49,29.34
  Bottom Layer w1.016: v2(15.44,29.28) 15.44,27.63 v2(17.21,25.85)
$3N961: length 12.7
  Top Layer w1.016: 54.06,20.07 52.7,20.07 50.8,21.97 L2.2 48.64,22.1 42.82,22.1 D1.1
$3N15267: length 2.7
  Top Layer w0.254: R24.2 17.65,64.13
$3N17066: length 2.8
  Top Layer w0.508: R20.1 LED2.2

## Copper pours and planes (outline as drawn; the poured copper is in the pictures)
GND on Top Layer: -1.02,65.79 81.92,65.79 81.92,0 -1.02,0
GND on Bottom Layer: 0.58,67.64 80.77,67.64 80.77,-1.52 0.58,-1.52

## Text on the board
Top Silkscreen Layer: G | V | +5 | H | L | B0 | B1 | SDA | SCL | CLK | MOSI | RST | DC | CS | BLK
